# Altium project Ethernet2MIL Adapter.PrjPcb (part 2 of 3)

## Sheet Ethernet_PHY.SchDoc
size A2; SheetNumber: 11; SheetTotal: 14
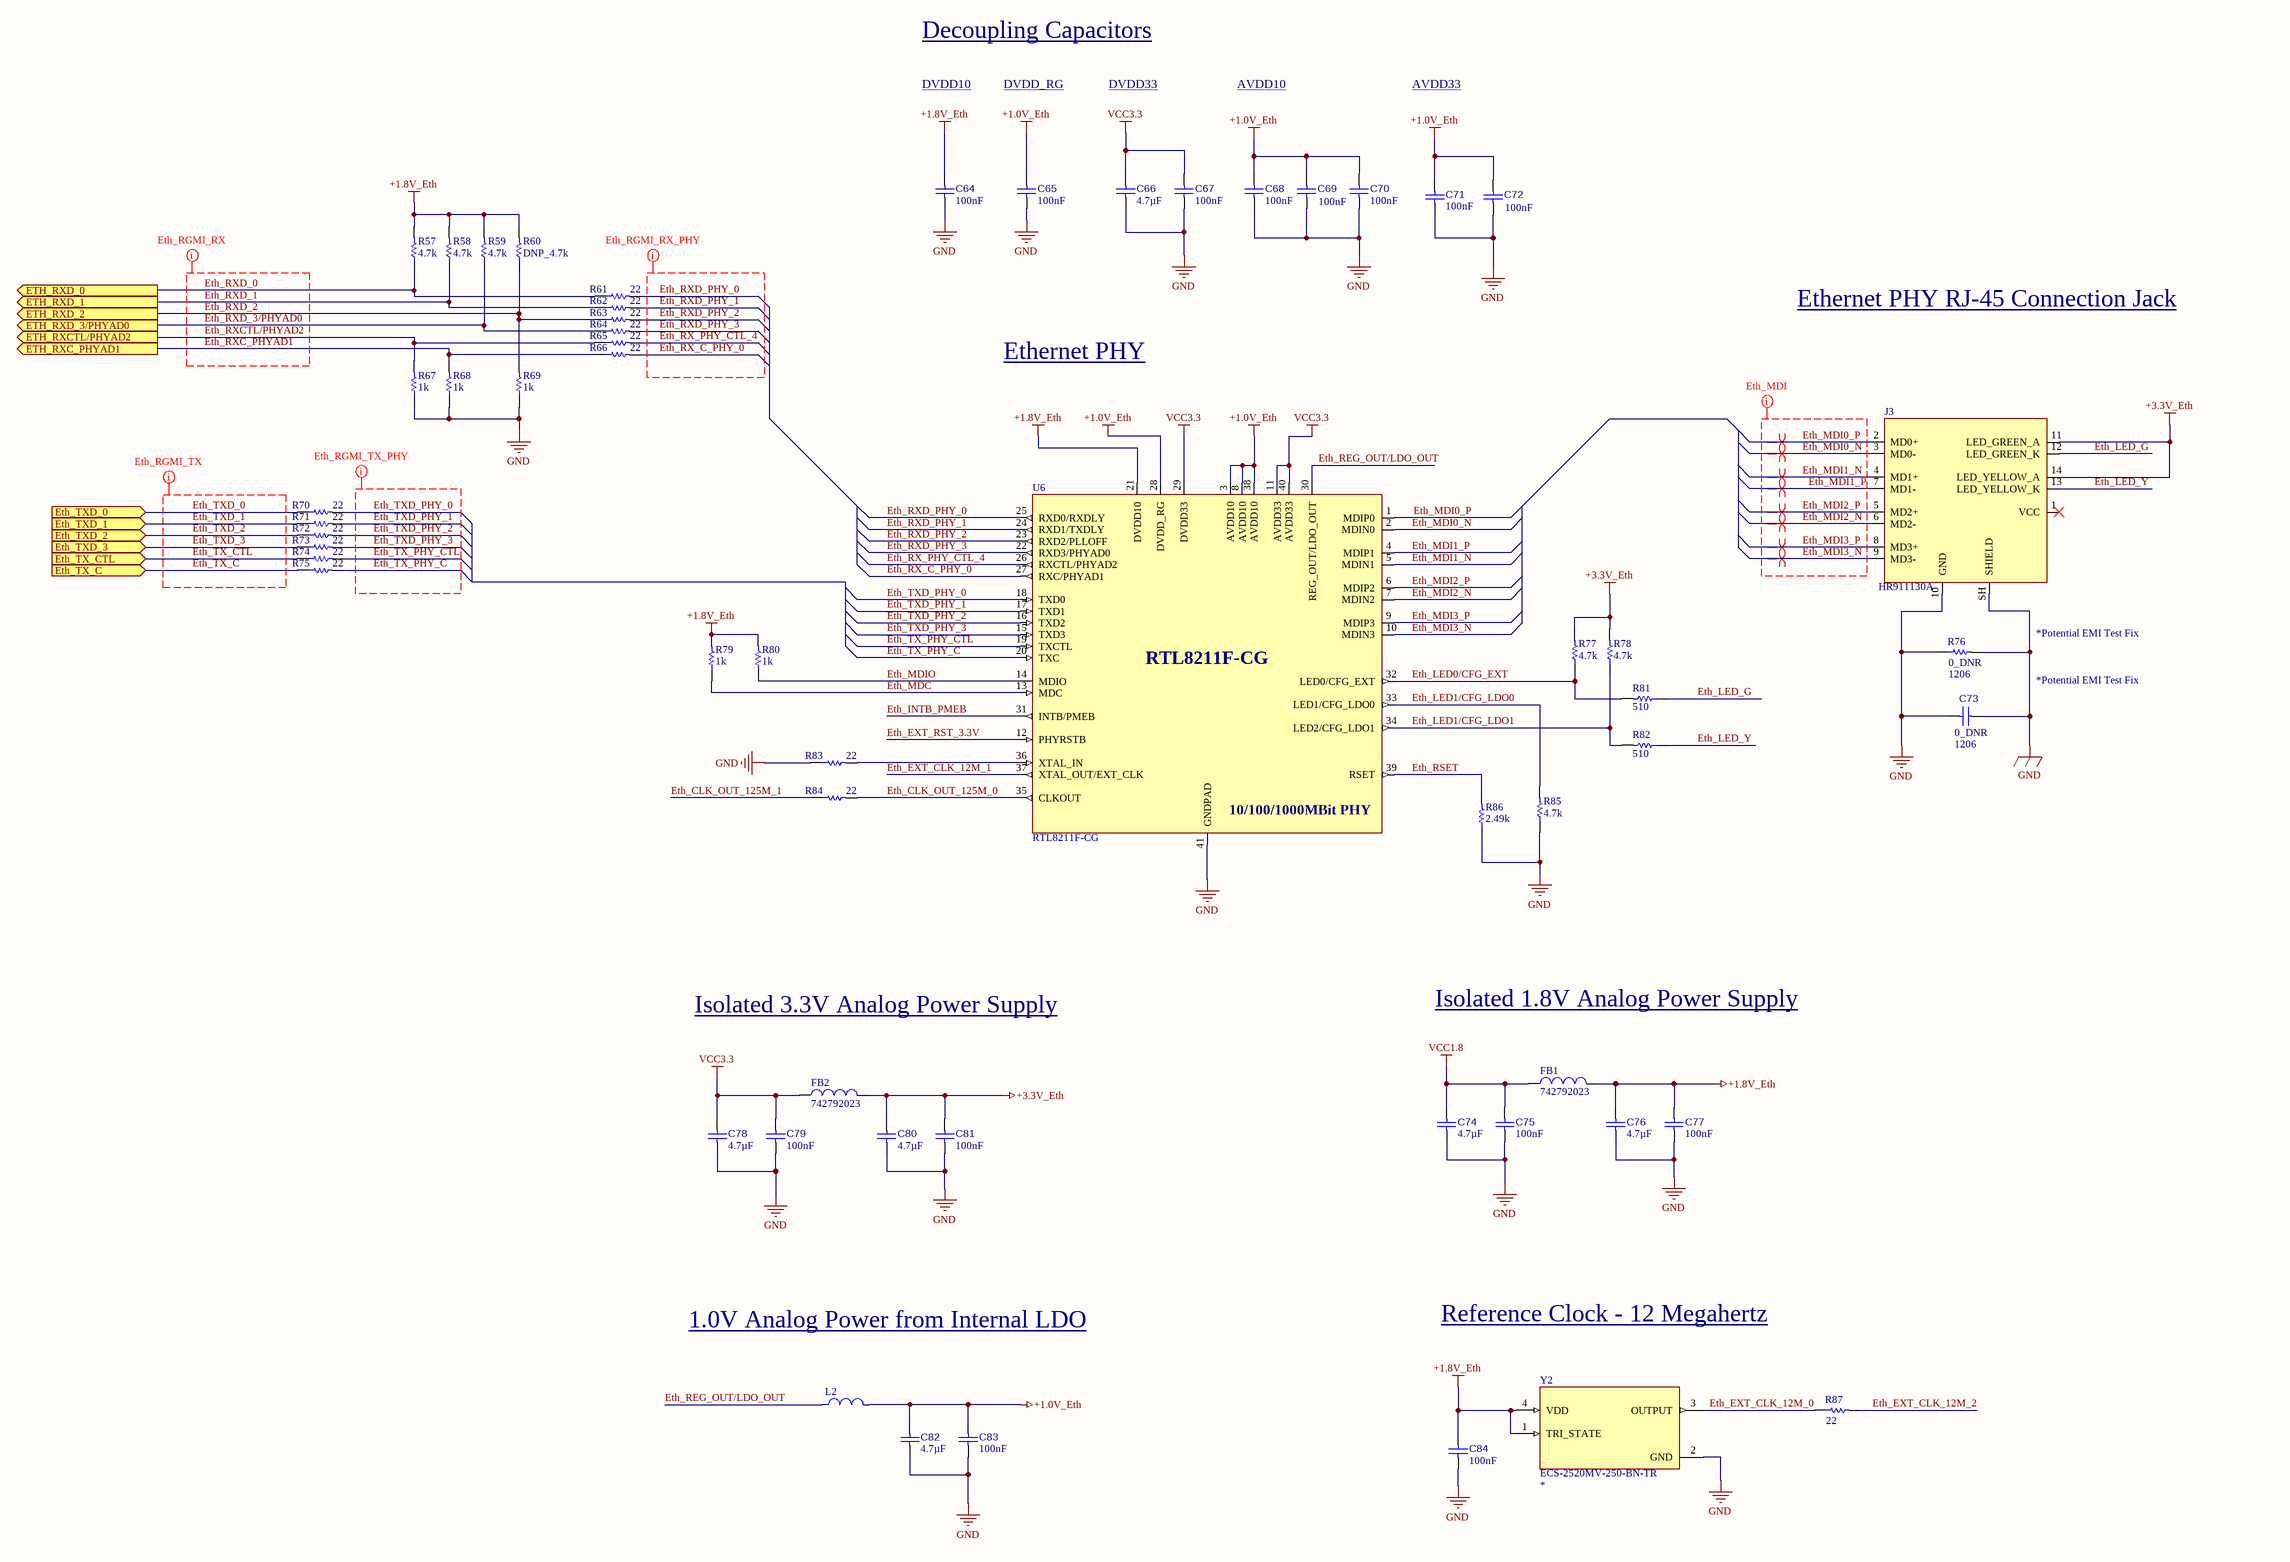
[diagram p6: Ethernet_PHY.SchDoc]

### Parts
C64  value 100nF  [CAPC1608X90X40NL10T20]  (hidden comment: Capacitor 100 nF +/-10% 50 V 0603)
C65  value 100nF  [CAPC1608X90X40NL10T20]  (hidden comment: Capacitor 100 nF +/-10% 50 V 0603)
C66  value 4.7µF  [CAPC0603(1608)100_L]  (hidden comment: Capacitor 4.7µF +/-20% 10V 0603)
C67  value 100nF  [CAPC1608X90X40NL10T20]  (hidden comment: Capacitor 100 nF +/-10% 50 V 0603)
C68  value 100nF  [CAPC1608X90X40NL10T20]  (hidden comment: Capacitor 100 nF +/-10% 50 V 0603)
C69  value 100nF  [CAPC1608X90X40NL10T20]  (hidden comment: Capacitor 100 nF +/-10% 50 V 0603)
C70  value 100nF  [CAPC1608X90X40NL10T20]  (hidden comment: Capacitor 100 nF +/-10% 50 V 0603)
C71  value 100nF  [CAPC1608X90X40NL10T20]  (hidden comment: Capacitor 100 nF +/-10% 50 V 0603)
C72  value 100nF  [CAPC1608X90X40NL10T20]  (hidden comment: Capacitor 100 nF +/-10% 50 V 0603)
C73  value 0_DNR  Case/Package: 1206  [CAPC3216X180X20ML20]  (hidden comment: Capacitor 1 uF +/- 10% 25 V 1206)
C74  value 4.7µF  [CAPC0603(1608)100_L]  (hidden comment: Capacitor 4.7µF +/-20% 10V 0603)
C75  value 100nF  [CAPC1608X90X40NL10T20]  (hidden comment: Capacitor 100 nF +/-10% 50 V 0603)
C76  value 4.7µF  [CAPC0603(1608)100_L]  (hidden comment: Capacitor 4.7µF +/-20% 10V 0603)
C77  value 100nF  [CAPC1608X90X40NL10T20]  (hidden comment: Capacitor 100 nF +/-10% 50 V 0603)
C78  value 4.7µF  [CAPC0603(1608)100_L]  (hidden comment: Capacitor 4.7µF +/-20% 10V 0603)
C79  value 100nF  [CAPC1608X90X40NL10T20]  (hidden comment: Capacitor 100 nF +/-10% 50 V 0603)
C80  value 4.7µF  [CAPC0603(1608)100_L]  (hidden comment: Capacitor 4.7µF +/-20% 10V 0603)
C81  value 100nF  [CAPC1608X90X40NL10T20]  (hidden comment: Capacitor 100 nF +/-10% 50 V 0603)
C82  value 4.7µF  [CAPC0603(1608)100_L]  (hidden comment: Capacitor 4.7µF +/-20% 10V 0603)
C83  value 100nF  [CAPC1608X90X40NL10T20]  (hidden comment: Capacitor 100 nF +/-10% 50 V 0603)
C84  value 100nF  [CAPC1608X90X40NL10T20]  (hidden comment: Capacitor 100 nF +/-10% 50 V 0603)
FB1  742792023  [WE-CBF_0805_L2W1.2H0.9_HC]
FB2  742792023  [WE-CBF_0805_L2W1.2H0.9_HC]
J3  HR911130A  [HR911130A]
L2  LQM18PN3R3MGHD  [FP-LQM18PN_GH-MFG]  (value not drawn)
R57  value 4.7k  [RESC1005X40X25ML05T05]  (hidden comment: Resistor 4k7 +/-1% 0402 100 mW)
R58  value 4.7k  [RESC1005X40X25ML05T05]  (hidden comment: Resistor 4k7 +/-1% 0402 100 mW)
R59  value 4.7k  [RESC1005X40X25ML05T05]  (hidden comment: Resistor 4k7 +/-1% 0402 100 mW)
R60  value DNP_4.7k  [RESC1005X40X25ML05T05]  (hidden comment: Resistor 4k7 +/-1% 0402 100 mW)  (net tie, no BOM)
R61  value 22  [RESC0402(1005)_L]  (hidden comment: Resistor 22R  +/-5 % 0402 63 mW)
R62  value 22  [RESC0402(1005)_L]  (hidden comment: Resistor 22R  +/-5 % 0402 63 mW)
R63  value 22  [RESC0402(1005)_L]  (hidden comment: Resistor 22R  +/-5 % 0402 63 mW)
R64  value 22  [RESC0402(1005)_L]  (hidden comment: Resistor 22R  +/-5 % 0402 63 mW)
R65  value 22  [RESC0402(1005)_L]  (hidden comment: Resistor 22R  +/-5 % 0402 63 mW)
R66  value 22  [RESC0402(1005)_L]  (hidden comment: Resistor 22R  +/-5 % 0402 63 mW)
R67  value 1k  [RESC1005X40X25ML05T05]  (hidden comment: Resistor 1k +/-1% 0402 100 mW)
R68  value 1k  [RESC1005X40X25ML05T05]  (hidden comment: Resistor 1k +/-1% 0402 100 mW)
R69  value 1k  [RESC1005X40X25ML05T05]  (hidden comment: Resistor 1k +/-1% 0402 100 mW)
R70  value 22  [RESC0402(1005)_L]  (hidden comment: Resistor 22R  +/-5 % 0402 63 mW)
R71  value 22  [RESC0402(1005)_L]  (hidden comment: Resistor 22R  +/-5 % 0402 63 mW)
R72  value 22  [RESC0402(1005)_L]  (hidden comment: Resistor 22R  +/-5 % 0402 63 mW)
R73  value 22  [RESC0402(1005)_L]  (hidden comment: Resistor 22R  +/-5 % 0402 63 mW)
R74  value 22  [RESC0402(1005)_L]  (hidden comment: Resistor 22R  +/-5 % 0402 63 mW)
R75  value 22  [RESC0402(1005)_L]  (hidden comment: Resistor 22R  +/-5 % 0402 63 mW)
R76  value 0_DNR  Case/Package: 1206  [RESC3116X70X50ML13T20]  (hidden comment: Resistor 0R +/- 0.05% 1206 250 mW)
R77  value 4.7k  [RESC1005X40X25ML05T05]  (hidden comment: Resistor 4k7 +/-1% 0402 100 mW)
R78  value 4.7k  [RESC1005X40X25ML05T05]  (hidden comment: Resistor 4k7 +/-1% 0402 100 mW)
R79  value 1k  [RESC1005X40X25ML05T05]  (hidden comment: Resistor 1k +/-1% 0402 100 mW)
R80  value 1k  [RESC1005X40X25ML05T05]  (hidden comment: Resistor 1k +/-1% 0402 100 mW)
R81  value 510  [RESC1005X40X25NL05T10]  (hidden comment: RC0402FR-07510RL)
R82  value 510  [RESC1005X40X25NL05T10]  (hidden comment: RC0402FR-07510RL)
R83  value 22  [RESC0402(1005)_L]  (hidden comment: Resistor 22R  +/-5 % 0402 63 mW)
R84  value 22  [RESC0402(1005)_L]  (hidden comment: Resistor 22R  +/-5 % 0402 63 mW)
R85  value 4.7k  [RESC1005X40X25ML05T05]  (hidden comment: Resistor 4k7 +/-1% 0402 100 mW)
R86  value 2.49k  [RESC1005X40X25NL05T10]  (hidden comment: RC0402FR-072K49L)
R87  value 22  [RESC0402(1005)_L]  (hidden comment: Resistor 22R  +/-5 % 0402 63 mW)
U6  RTL8211F-CG  [QFN-40-0.4-EP]
Y2  ECS-2520MV-250-BN-TR  [OSC_ECS-2520S25-250-FN-TR]

### Ports
ETH_RXC_PHYAD1 (out), ETH_RXCTL/PHYAD2 (out), ETH_RXD_0 (out), ETH_RXD_1 (out), ETH_RXD_2 (out), ETH_RXD_3/PHYAD0 (out), Eth_TX_C (in), Eth_TX_CTL (in), Eth_TXD_0 (in), Eth_TXD_1 (in), Eth_TXD_2 (in), Eth_TXD_3 (in)

### Nets
+1.0V_Eth: C65.2 C68.2 C69.2 C70.2 C71.2 C72.2 C82.2 C83.2 L2.2 U6.3(AVDD10) U6.8(AVDD10) U6.28(DVDD_RG) U6.38(AVDD10)
+1.8V_Eth: C64.2 C76.2 C77.2 C84.2 FB1.2 R57.2 R58.2 R59.2 R60.2 R79.2 R80.2 U6.21(DVDD10) Y2.1(TRI_STATE) Y2.4(VDD)
+3.3V_Eth: C80.2 C81.2 FB2.2 J3.11(LED_GREEN_A) J3.14(LED_YELLOW_A) R77.2 R78.2
GND: C64.1 C65.1 C66.1 C67.1 C68.1 C69.1 C70.1 C71.1 C72.1 C73.1 C73.2 C74.1 C75.1 C76.1 C77.1 C78.1 C79.1 C80.1 C81.1 C82.1 C83.1 C84.1 J3.10(GND) J3.SH(SHIELD) R67.1 R68.1 R69.1 R76.1 R76.2 R83.1 R85.1 R86.1 U6.41(GNDPAD) Y2.2(GND)
VCC1.8: C74.2 C75.2 FB1.1
VCC3.3: C66.2 C67.2 C78.2 C79.2 FB2.1 U6.11(AVDD33) U6.29(DVDD33) U6.40(AVDD33)
Eth_CLK_OUT_125M_0: R84.2 U6.35(CLKOUT)
Eth_CLK_OUT_125M_1: R84.1
Eth_EXT_CLK_12M_0: R87.1 Y2.3(OUTPUT)
Eth_EXT_CLK_12M_1: U6.37(XTAL_OUT/EXT_CLK)
Eth_EXT_CLK_12M_2: R87.2
Eth_EXT_RST_3.3V: U6.12(PHYRSTB)
Eth_INTB_PMEB: U6.31(INTB/PMEB)
Eth_LED0/CFG_EXT: R77.1 R81.2 U6.32(LED0/CFG_EXT)
Eth_LED1/CFG_LDO0: R85.2 U6.33(LED1/CFG_LDO0)
Eth_LED1/CFG_LDO1: R78.1 R82.2 U6.34(LED2/CFG_LDO1)
Eth_LED_G: J3.12(LED_GREEN_K) R81.1
Eth_LED_Y: J3.13(LED_YELLOW_K) R82.1
Eth_MDC: R79.1 U6.13(MDC)
Eth_MDI0_N: J3.3(MD0-) U6.2(MDIN0)
Eth_MDI0_P: J3.2(MD0+) U6.1(MDIP0)
Eth_MDI1_N: J3.4(MD1+) U6.5(MDIN1)
Eth_MDI1_P: J3.7(MD1-) U6.4(MDIP1)
Eth_MDI2_N: J3.6(MD2-) U6.7(MDIN2)
Eth_MDI2_P: J3.5(MD2+) U6.6(MDIP2)
Eth_MDI3_N: J3.9(MD3-) U6.10(MDIN3)
Eth_MDI3_P: J3.8(MD3+) U6.9(MDIP3)
Eth_MDIO: R80.1 U6.14(MDIO)
Eth_REG_OUT/LDO_OUT: L2.1 U6.30(REG_OUT/LDO_OUT)
Eth_RSET: R86.2 U6.39(RSET)
Eth_RX_C_PHY_0: R66.2 U6.27(RXC/PHYAD1)
Eth_RX_PHY_CTL_4: R65.2 U6.26(RXCTL/PHYAD2)
Eth_RXC_PHYAD1: R66.1 R68.2 ; port ETH_RXC_PHYAD1
Eth_RXCTL/PHYAD2: R65.1 R67.2 ; port ETH_RXCTL/PHYAD2
Eth_RXD_0: R57.1 R61.1 ; port ETH_RXD_0
Eth_RXD_1: R58.1 R62.1 ; port ETH_RXD_1
Eth_RXD_2: R60.1 R63.1 R69.2 ; port ETH_RXD_2
Eth_RXD_3/PHYAD0: R59.1 R64.1 ; port ETH_RXD_3/PHYAD0
Eth_RXD_PHY_0: R61.2 U6.25(RXD0/RXDLY)
Eth_RXD_PHY_1: R62.2 U6.24(RXD1/TXDLY)
Eth_RXD_PHY_2: R63.2 U6.23(RXD2/PLLOFF)
Eth_RXD_PHY_3: R64.2 U6.22(RXD3/PHYAD0)
Eth_TX_C: R75.1 ; port Eth_TX_C
Eth_TX_CTL: R74.1 ; port Eth_TX_CTL
Eth_TX_PHY_C: R75.2 U6.20(TXC)
Eth_TX_PHY_CTL: R74.2 U6.19(TXCTL)
Eth_TXD_0: R70.1 ; port Eth_TXD_0
Eth_TXD_1: R71.1 ; port Eth_TXD_1
Eth_TXD_2: R72.1 ; port Eth_TXD_2
Eth_TXD_3: R73.1 ; port Eth_TXD_3
Eth_TXD_PHY_0: R70.2 U6.18(TXD0)
Eth_TXD_PHY_1: R71.2 U6.17(TXD1)
Eth_TXD_PHY_2: R72.2 U6.16(TXD2)
Eth_TXD_PHY_3: R73.2 U6.15(TXD3)
NetR83_2: R83.2 U6.36(XTAL_IN)

Not connected (* = marked no-connect by the designer): J3 1(VCC)*

### Layout directives
net class Ethernet RGMI Rx PHY: Eth_RX_C_PHY_0, Eth_RX_PHY_CTL_4, Eth_RXD_PHY_0, Eth_RXD_PHY_1, Eth_RXD_PHY_2, Eth_RXD_PHY_3
net class Ethernet RGMI Tx PHY: Eth_TX_PHY_C, Eth_TX_PHY_CTL, Eth_TXD_PHY_0, Eth_TXD_PHY_1, Eth_TXD_PHY_2, Eth_TXD_PHY_3
net class Ethernet MDI: Eth_MDI0_N, Eth_MDI0_P, Eth_MDI1_N, Eth_MDI1_P, Eth_MDI2_N, Eth_MDI2_P, Eth_MDI3_N, Eth_MDI3_P
net class Ethernet RGMI TX: Eth_TX_C, Eth_TX_CTL, Eth_TXD_0, Eth_TXD_1, Eth_TXD_2, Eth_TXD_3
net class Ethernet RGMI Rx: Eth_RXC_PHYAD1, Eth_RXCTL/PHYAD2, Eth_RXD_0, Eth_RXD_1, Eth_RXD_2, Eth_RXD_3/PHYAD0
differential pair: Eth_MDI0_N, Eth_MDI0_P, Eth_MDI1_N, Eth_MDI1_P, Eth_MDI2_N, Eth_MDI2_P, Eth_MDI3_N, Eth_MDI3_P

### Notes on the sheet
- Decoupling Capacitors
- DVDD10
- DVDD_RG
- DVDD33
- AVDD10
- AVDD33
- Ethernet PHY
- Ethernet PHY RJ-45 Connection Jack
- *Potential EMI Test Fix
- Isolated 3.3V Analog Power Supply
- Isolated 1.8V Analog Power Supply
- 1.0V Analog Power from Internal LDO
- Reference Clock - 12 Megahertz
- (in symbol CMP-049-000049-1) 10/100/1000MBit PHY

### Library data of the parts
C64 C65 C67-C72 C75 C77 C79 C81 C83 C84 = CMP-001-00017-7: Chip Capacitor, 100 nF, +/- 10%, 50 V, 0603 (1608 Metric); Voltage Rating: 50V; Capacitor Type: Ceramic; Mounting Technology: SM; Pins: 2; Tolerance: 10%; Case/Package: 0603; Max Operating Temperature: 125°C; Min Operating Temperature: -55°C; RoHS Compliant: True
C66 C74 C76 C78 C80 C82 = CMP-001-00076-5: Chip Capacitor, 4.7µF +/-20%, 10V, 0603, Thickness 1 mm; Tolerance: 10%; Max Operating Temperature: 85°C; Min Operating Temperature: -55°C; Voltage Rating: 10V; Pins: 2; Mounting Technology: SMT; Case/Package: 0603
C73 = CMP-001-00006-7: Chip Capacitor, 1 uF, +/- 10%, 25 V, 1206 (3216 Metric); Voltage Rating: 25V; Capacitor Type: Ceramic; Mounting Technology: SM; Max Operating Temperature: 125°C; RoHS Compliant: True; Tolerance: 10%; Pins: 2; Min Operating Temperature: -55°C
FB1 FB2 = CMP-0220-00030-2: NexarPartId: 8916989; Manufacturer: Wurth Electronics; Number of Lines: 1; Impedance: 120Ω; Max Current Rating: 3A; Tolerance: 25%; Resistance: 30mΩ; Shielding: Unshielded; Inductance: 1H; Test Frequency: 100MHz; DC Resistance-Max: 30mR; Filter Type: FERRITE CHIP; Clock Frequency: 250MHz; Output Impedance: 120R; Height: 900µm; REACH SVHC: Unknown; Termination: SMD/SMT; Weight: 10.999615mg; Max Operating Temperature: 125°C; Length: 2mm; Min Operating Temperature: -55°C; Case Code (Imperial): 0805; Core Material: Ferrite; Current Rating: 3A; Lead Free: Lead Free; Mount: Surface Mount; Width: 1.2mm; Case Code (Metric): 2012; RoHS: Compliant; Case/Package: SMD/SMT; Max DC Current: 3A; Depth: 1.2mm; Packaging: Cut Tape (CT); DC Resistance (DCR): 30mΩ; Supplier: Newark; Supplier Part Number: 24AC5582; Manufacturer Part Number: 742792023; Category: Ferrite Beads and Chips; Stock: 8000; Pricing: 4000=0.17 (USD); Mounting Technology: Surface Mount; Material: Ferrite; Case Code: 0805; Terminal Finish: Nickel; Min Frequency: 100MHz; Channels: 1; JESD-609 Code: e3; Construction: Multi-Layer; Reach SVHC Compliant: Yes; RoHS Compliant: Yes; ComponentLink1URL: https://datasheet.ciiva.com:443/pdfs/VipMasterIC/IC/MIDC/MIDC-S-A0008919821/MIDC-S-A0008918329-1.pdf?src-supplier=IHS+Markit; ComponentLink1Description: https://datasheet.ciiva.com:443/pdfs/VipMasterIC/IC/MIDC/MIDC-S-A0008919821/MIDC-S-A0008918329-1.pdf?src-supplier=IHS+Markit; ComponentLink2URL: https://datasheet.ciiva.com/1013/742792023-1013536.pdf?src-supplier=Digikey; ComponentLink2Description: https://datasheet.ciiva.com/1013/742792023-1013536.pdf?src-supplier=Digikey; ComponentLink3URL: https://datasheet.ciiva.com/4940/742792023-80959-4940415.pdf?src-supplier=Mouser; ComponentLink3Description: https://datasheet.ciiva.com/4940/742792023-80959-4940415.pdf?src-supplier=Mouser; ComponentLink4URL: https://datasheet.ciiva.com/11803/0900766b80bbd134-11803678.pdf?src-supplier=Rs; ComponentLink4Description: https://datasheet.ciiva.com/11803/0900766b80bbd134-11803678.pdf?src-supplier=Rs; ComponentLink5URL: https://datasheet.ciiva.com/1126/1695980-1126531.pdf?src-supplier=Element14; ComponentLink5Description: https://datasheet.ciiva.com/1126/1695980-1126531.pdf?src-supplier=Element14; ComponentLink6URL: https://datasheet.ciiva.com/6739/742792023-6739069.pdf?src-supplier=Newark; ComponentLink6Description: https://datasheet.ciiva.com/6739/742792023-6739069.pdf?src-supplier=Newark; ComponentLink7URL: https://datasheet.ciiva.com/1013/742792023-1013537.pdf?src-supplier=Digikey; ComponentLink7Description: https://datasheet.ciiva.com/1013/742792023-1013537.pdf?src-supplier=Digikey; ComponentLink8URL: https://datasheet.ciiva.com/1013/742792023-1013538.pdf?src-supplier=Digikey; ComponentLink8Description: https://datasheet.ciiva.com/1013/742792023-1013538.pdf?src-supplier=Digikey; ComponentLink9URL: https://datasheet.ciiva.com/48698/001086956-da-01-ml-we-cbf-smd-ferrit-742792023-de-en-48698517.pdf?src-supplier=Conrad; ComponentLink9Description: https://datasheet.ciiva.com/48698/001086956-da-01-ml-we-cbf-smd-ferrit-742792023-de-en-48698517.pdf?src-supplier=Conrad
J3 = CMP-002-00088-1: 100/1000Base-T Magnetics Single-Port RJ45 Connector with Integrated Magnetics and LEDs; Manufacturer: Hanrun; Manufacturer Part Number: HR911130A; Source: Schematic-Lib-PhilsLab.SchLib; Design Item ID: HR911130A
L2 = CMP-006-00047-1: General Purpose Inductor, 3.3uH, 20%, 1 Element, Ferrite-Core, SMD, 0603; Max Current Rating: 1.05A; Self Resonant Frequency: 30MHz; RoHS Compliant: Yes; Max Operating Temperature: 85°C; Min Operating Temperature: -40°C; Pins: 2; Tolerance: 20%
R57-R60 R77 R78 R85 = CMP-009-00030-6: Chip Resistor, 4.7 KOhm, +/- 1%, 0.1 W, -55 to 155 degC, 0402 (1005 Metric); Voltage Rating: 50V; Power: 100mW; Max Operating Temperature: 155°C; RoHS Compliant: True; Min Operating Temperature: -55°C; Pins: 2; Tolerance: 1%; Mounting Technology: SM; Case/Package: 0402
R61-R66 R70-R75 R83 R84 R87 = CMP-009-00164-4: Chip Resistor, 22 Ohms, +/-5 %, 63 mW, -55 to 155 degC, 0402; Power: 63mW; Tolerance: 5%; Max Operating Temperature: 155°C; Pins: 2; Min Operating Temperature: -55°C; Case/Package: 0402
R67-R69 R79 R80 = CMP-009-00009-5: Chip Resistor, 1 KOhm, +/- 1%, 0.1 W, -55 to 155 degC, 0402 (1005 Metric); Power: 100mW; Voltage Rating: 50V; Min Operating Temperature: -55°C; Max Operating Temperature: 155°C; RoHS Compliant: True; Mounting Technology: SM; Pins: 2; Tolerance: 1%; Case/Package: 0402
R76 = CMP-009-00008-6: Chip Resistor, 0 Ohm, 0.25 W, -55 to 155 degC, 1206 (3216 Metric); Voltage Rating: 200V; Power: 0_DNR; RoHS Compliant: True; Max Operating Temperature: 155°C; Mounting Technology: SM; Min Operating Temperature: -55°C; Tolerance: 0.05%; Pins: 2
R81 R82 = CMP-009-00202-1: Fixed Resistor, Metal Glaze/thick Film, 0.0625W, 510ohm, 50V, 1% +/-Tol, 100ppm/Cel, Surface Mount, 0402; Power: 62.5mW; Pins: 2; Max Operating Temperature: 155°C; Case/Package: 0402; Tolerance: 1%; Min Operating Temperature: -55°C; RoHS Compliant: Yes; Mounting Technology: Surface Mount
R86 = CMP-009-00200-1: Fixed Resistor, Metal Glaze/thick Film, 0.0625W, 2490ohm, 50V, 1% +/-Tol, 100ppm/Cel, Surface Mount, 0402; Power: 62.5mW; Case/Package: 0402; Pins: 2; Mounting Technology: Surface Mount; Tolerance: 1%; Max Operating Temperature: 155°C; Min Operating Temperature: -55°C; RoHS Compliant: Yes
U6 = CMP-049-000049-1: INTEGRATED 10/100/1000M ETHERNET PRECISION TRANSCEIVER; Manufacturer: Realtek; Manufacturer Part Number: RTL8211F-CG; Design Item ID: RTL8211F-CG; Source: Schematic-Lib-PhilsLab.SchLib
Y2 = CMP-029-000000-1: 25 MHz XO (Standard) HCMOS Oscillator 1.6V ~ 3.6V Enable/Disable 4-SMD, No Lead; MF: ECS Inc.; Design Item ID: ECS-2520MV-250-BN-TR; MP: ECS-2520MV-250-BN-TR; Component Type: Standard; Value: *; SnapEDA_Link: https://www.snapeda.com/parts/ECS-2520MV-250-BN-TR/ECS/view-part/?ref=snap; Pin Count: 4; Source: ECS-2520MV-250-BN-TR.SchLib; Check_prices: https://www.snapeda.com/parts/ECS-2520MV-250-BN-TR/ECS/view-part/?ref=eda; Package: ECS-2520MV-0-4 ECS

## Sheet Mechancils.SchDoc
size A; SheetNumber: 14; SheetTotal: 14
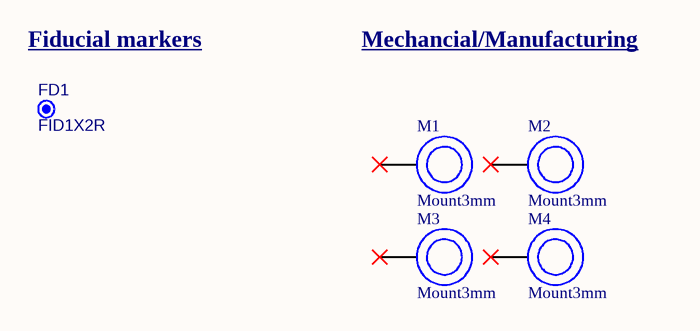
[diagram p7: Mechancils.SchDoc]

### Parts
FD1  FID1X2R  [FID1X2R]  (no BOM)
M1  Mount3mm  [Mount3mm-Footprint-1]  (no BOM)
M2  Mount3mm  [Mount3mm-Footprint-1]  (mechanical)
M3  Mount3mm  [Mount3mm-Footprint-1]  (mechanical)
M4  Mount3mm  [Mount3mm-Footprint-1]  (mechanical)

### Nets

Not connected (* = marked no-connect by the designer): M1 1(Sheild/GND); M2 1(Sheild/GND); M3 1(Sheild/GND); M4 1(Sheild/GND)

### Notes on the sheet
- (near FD1) Fiducial markers
- Mechancial/Manufacturing

### Library data of the parts
FD1 = CMP-00028-00005-2: Fiducial - Round 1x2mm; Pins: 0
M1-M4 = CMP-00028-00009-1: Mounting holes with 3mm holes.

## Sheet Power_SwitchRegulators.SchDoc
size A2; SheetNumber: 3; SheetTotal: 14
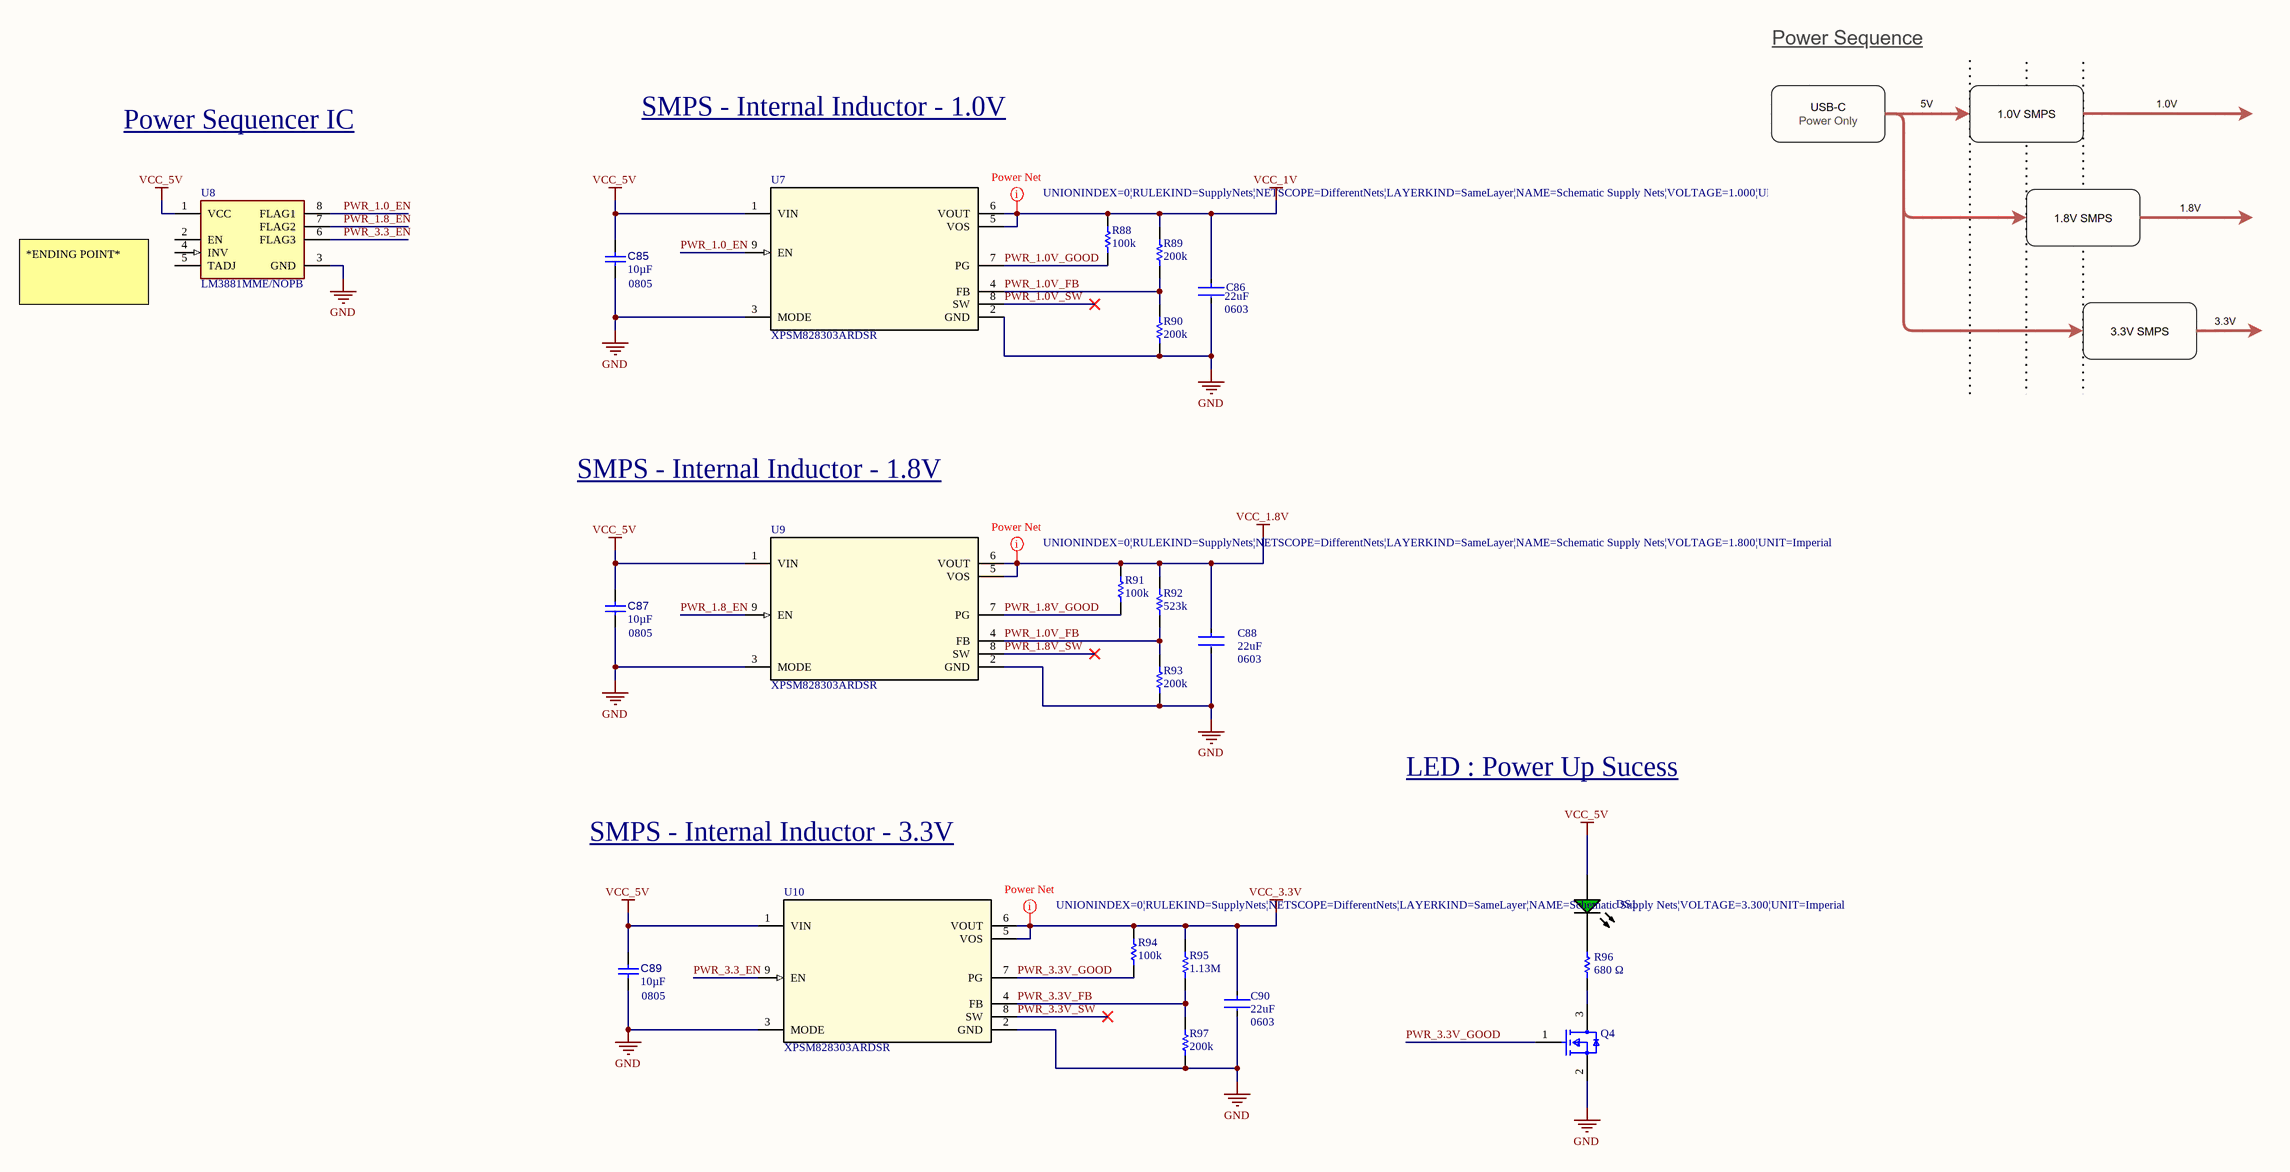
[diagram p8: Power_SwitchRegulators.SchDoc]

### Parts
C85  value 10µF  Case/Package: 0805  [CAPC0805(2012)145_L]  (hidden comment: Capacitor 10µF +/-20% 25V 0805)
C86  Capacitance: 22uF  Case/Package: 0603  [FP-GRM188-0_2-IPC_C]  (hidden comment: GRM188R60J226MEA0J)
C87  value 10µF  Case/Package: 0805  [CAPC0805(2012)145_L]  (hidden comment: Capacitor 10µF +/-20% 25V 0805)
C88  Capacitance: 22uF  Case/Package: 0603  [FP-GRM188-0_2-IPC_C]  (hidden comment: GRM188R60J226MEA0J)
C89  value 10µF  Case/Package: 0805  [CAPC0805(2012)145_L]  (hidden comment: Capacitor 10µF +/-20% 25V 0805)
C90  Capacitance: 22uF  Case/Package: 0603  [FP-GRM188-0_2-IPC_C]  (hidden comment: GRM188R60J226MEA0J)
DS1  HSMG-C170  [AVAG-HSMX-C170_V]  (value not drawn)
Q4  BSS138  [FP-318-08-IPC_B]  (value not drawn)
R88  value 100k  [RESC1005X40X25ML05T05]  (hidden comment: Resistor 100k +/-1% 0402 63 mW)
R89  value 200k  [RESC0402(1005)_L]  (hidden comment: Resistor 200K +/-1 % 0402 63 mW)
R90  value 200k  [RESC0402(1005)_L]  (hidden comment: Resistor 200K +/-1 % 0402 63 mW)
R91  value 100k  [RESC1005X40X25ML05T05]  (hidden comment: Resistor 100k +/-1% 0402 63 mW)
R92  value 523k  [RESC1005X40X25LL10T10]  (hidden comment: CR0402-FX-5233GLF)
R93  value 200k  [RESC0402(1005)_L]  (hidden comment: Resistor 200K +/-1 % 0402 63 mW)
R94  value 100k  [RESC1005X40X25ML05T05]  (hidden comment: Resistor 100k +/-1% 0402 63 mW)
R95  value 1.13M  [RESC1005X40X25NL05T05]  (hidden comment: CRCW04021M13FKED)
R96  Resistance: 680 Ω  [RESC1608X55X25ML10T15]  (hidden comment: RC0603JR-070RL)
R97  value 200k  [RESC0402(1005)_L]  (hidden comment: Resistor 200K +/-1 % 0402 63 mW)
U7  XPSM828303ARDSR  [RDS0009A-MFG]
U8  LM3881MME/NOPB  [FP-DGK0008A-IPC_B]
U9  XPSM828303ARDSR  [RDS0009A-MFG]
U10  XPSM828303ARDSR  [RDS0009A-MFG]

### Nets
GND: C85.1 C86.2 C87.1 C88.2 C89.1 C90.2 Q4.2(S) R90.1 R93.1 R97.1 U7.2(GND) U7.3(MODE) U8.3(GND) U9.2(GND) U9.3(MODE) U10.2(GND) U10.3(MODE)
VCC_1.8V: C88.1 R91.2 R92.1 U9.5(VOS) U9.6(VOUT)
VCC_1V: C86.1 R88.2 R89.2 U7.5(VOS) U7.6(VOUT)
VCC_3.3V: C90.1 R94.2 R95.2 U10.5(VOS) U10.6(VOUT)
VCC_5V: C85.2 C87.2 C89.2 DS1.1(A) U7.1(VIN) U8.1(VCC) U9.1(VIN) U10.1(VIN)
PWR_1.0_EN: U7.9(EN) U8.8(FLAG1)
PWR_1.0V_FB: R89.1 R90.2 R92.2 R93.2 U7.4(FB) U9.4(FB)
PWR_1.0V_GOOD: R88.1 U7.7(PG)
PWR_1.0V_SW: U7.8(SW)
PWR_1.8_EN: U8.7(FLAG2) U9.9(EN)
PWR_1.8V_GOOD: R91.1 U9.7(PG)
PWR_1.8V_SW: U9.8(SW)
PWR_3.3_EN: U8.6(FLAG3) U10.9(EN)
PWR_3.3V_FB: R95.1 R97.2 U10.4(FB)
PWR_3.3V_GOOD: Q4.1(G) R94.1 U10.7(PG)
PWR_3.3V_SW: U10.8(SW)
NetDS1_2: DS1.2(K) R96.1
NetQ4_3: Q4.3(D) R96.2

Not connected (* = marked no-connect by the designer): U8 2(EN) 4(INV) 5(TADJ)

### Layout directives
rule Supply Nets [Voltage = 1.000]: VCC_1V
rule Supply Nets [Voltage = 1.800]: VCC_1.8V
rule Supply Nets [Voltage = 3.300]: VCC_3.3V

### Notes on the sheet
- Power Sequencer IC
- SMPS - Internal Inductor - 1.0V
- *ENDING POINT*
- SMPS - Internal Inductor - 1.8V
- LED : Power Up Sucess
- SMPS - Internal Inductor - 3.3V

### Library data of the parts
C85 C87 C89 = CMP-001-00079-5: Chip Capacitor, 10µF +/-20%, 25V, 0805, Thickness 1.45 mm; Tolerance: 10%; Pins: 2; Voltage Rating: 25V; Mounting Technology: SMT; Min Operating Temperature: -55°C; Max Operating Temperature: 85°C
C86 C88 C90 = CMP-06035-027361-1: Chip Multilayer Ceramic Capacitors for General Purpose, 0603, 22uF, X5R, 15%, 20%, 6.3V; Case Code (Metric): 1608; Thickness: 0.039inch; Dielectric: X5R; Voltage Rating: 6.3V; Termination: SMD/SMT; Voltage Rating (DC): 6.3V; Width: 0.031inch; Weight: 0.000222oz; Tolerance: 20%; Lead Free: Lead Free; Package Quantity: 10000; Case Code (Imperial): 0603; Length: 0.063inch; Packaging: Tape and Reel; Max Operating Temperature: 85°C; Min Operating Temperature: -55°C; Mount: Surface Mount
DS1 = CMP-2000-05062-1: Chip LED, Green, 2.2 V, -40 to 85 degC, 2-Pin SMD, Pb-Free, Tape and Reel; Manufacturer: Avago; No. of Pins: 2; Peak Wavelength: 570nm; SVHC: NoSVHC(16-Jun-2014); Dominant Wavelength: 572nm; Forward Current If: 20mA; Viewing Angle: 170deg; Lens Shape: Rectangular; PIV Max: 5V; External Width: 1.25mm; LED Type: Standard; External Depth: 0.8mm; Opto Mounting Orientation: Top; Luminous Intensity: 15mcd; Luminous Intensity Min: 4mcd; Forward Voltage VF Max: 2.6V; External Length / Height: 2mm; Bulb Size: 1.25mmx1.4mm; Light Area Height: 1mm; Voltage Vf Typ: 2.2V; Operating Temperature Max: 85degC; Datasheet Version: Oct-08; MSL: MSL2A-4weeks; Peak Forward Current: 20mA; Package Description: 2-Pin Surface Mount Device, Body 2 x 1.25 mm, Height 0.8 mm; Datasheet URL: https://datasheet.ciiva.com/29280/180495-da-01-en-chip-led-hsmg-c170-gelb-gruen-29280971.pdf; Storage Temperature Min: -40degC; LED Colour: Green; Wavelength Typ: 570nm; Mounting Type: SMD; Forward Current If Max: 20mA; Dominant Wavelength Typ: 572nm; LED Mounting: SMD; Operating Temperature Range: -30degCto+85degC; Operating Temperature Min: -30degC; Manufacturer URL: http://www.avagotech.com/; Packaging: CutTape; Luminous Intensity Typ: 15mcd; Package Reference: HSMX-C170; Storage Temperature Max: 85degC; Opto Case Style: SMD; Forward Voltage: 2.2V
Q4 = CMP-07173-000101-1: MOSFET N-CH 50V 220MA SOT-23; Turn-Off Delay Time: 20ns; Element Configuration: Single; Rds On Max: 3.5R; Gate to Source Voltage (Vgs): 20V; Threshold Voltage: 1.3V; Number of Elements: 1; Power Dissipation: 360mW; Rise Time: 9ns; Turn-On Delay Time: 2.5ns; Input Capacitance: 27pF; On-State Resistance: 6R; Lead Free: Lead Free; Length: 2.92mm; Width: 1.3mm; Drain to Source Breakdown Voltage: 50V; Min Operating Temperature: -55°C; REACH SVHC: No SVHC; Packaging: Tape and Reel; Radiation Hardening: No; Height: 0.93mm; Drain to Source Voltage (Vdss): 50V; Current Rating: 220mA; Voltage Rating (DC): 50V; Weight: 0.03g; Continuous Drain Current (ID): 220mA; Number of Pins: 3; Nominal Vgs: 1.3V; Max Power Dissipation: 360mW; Fall Time: 9ns; Drain to Source Resistance: 3.5R; Contact Plating: Tin; Case/Package: SOT-23; Package Quantity: 1; Dual Supply Voltage: 50V; Mount: Surface Mount; Termination: SMD/SMT; Max Operating Temperature: 150°C
R88 R91 R94 = CMP-009-00021-6: Chip Resistor, 100 KOhm, +/- 1%, 0.063 W, -55 to 155 degC, 0402 (1005 Metric); Power: 63mW; Voltage Rating: 50V; Case/Package: 0402; RoHS Compliant: True; Max Operating Temperature: 155°C; Mounting Technology: SM; Tolerance: 1%; Min Operating Temperature: -55°C; Pins: 2
R89 R90 R93 R97 = CMP-009-00163-4: Chip Resistor, 200 kOhms, +/-1 %, 63 mW, -55 to 155 degC, 0402; Tolerance: 1%; Power: 63mW; Min Operating Temperature: -55°C; Pins: 2; Max Operating Temperature: 155°C; Case/Package: 0402
R92 = CMP-009-00203-1: Res Thick Film 0402 523K Ohm 1% 1/16W 100ppm/C Molded SMD SMD Paper Tape on Plastic Reel; Voltage Rating: 50V; Max Operating Temperature: 155°C; Case/Package: 0402; Mounting Technology: Surface Mount; Tolerance: 1%; Min Operating Temperature: -55°C
R95 = CMP-009-00207-1: Res Thick Film 0402 1.13M Ohm 1% 0.063W(1/16W) ±100ppm/C Pad SMD T/R Automotive; Voltage Rating: 50V; Max Operating Temperature: 155°C; Pins: 2; Mounting Technology: Surface Mount; Case/Package: 0402; Tolerance: 1%; Min Operating Temperature: -55°C
R96 = CMP-2100-03667-1: Chip Resistor, 0 Ohm, +/- 5%, 0.1 W, -55 to 155 degC, 0603 (1608 Metric), RoHS, Tape and Reel; Manufacturer: Yageo; Temperature Coefficient: 200ppm/degreesC; Voltage Rating: 50V; Power Rating: 100mW; Width: 0.8mm; Max Operating Temperature: 155degC; Tolerance: 5%; Package Reference: 0603; Height: 0.45mm; Depth: 0.8mm; Package Description: 2-Pin Surface Mount Device, Body 1.6 x 0.8 mm; Termination: SMD/SMT; Package Quantity: 5000; Case/Package: 0603; Case Code (Imperial): 0603; Radiation Hardening: No; Number of Pins: 2; Length: 1.6mm; Lead Free: LeadFree; Voltage Rating (DC): 50V; Military Standard: Not; Datasheet URL: http://www.yageo.com/NewPortal/yageodocoutput?fileName=/pdf/R-Chip/PYu-RC_Group_51_RoHS_L_5.pdf; Manufacturer URL: http://www.yageo.com/; Packaging: TapeandReel; Case Code (Metric): 1608; Min Operating Temperature: -55degC; Composition: ThickFilm; RoHSCompliant: true; Contact Plating: Tin; Datasheet Version: Rev. 5, 10/2016; REACH SVHC: NoSVHC
U7 U9 U10 = CMP-006-00049-1: 2.25-V to 5.5-V, 3-A, low-noise step-down module with integrated inductor in QFN package 9-QFN-FCMOD -40 to 125; Manufacturer_Name: Texas Instruments; Datasheet: https://www.ti.com/lit/gpn/tpsm828303; TYPE: TYPE; Copyright: Copyright (C) 2025 Ultra Librarian. All rights reserved.; Source: XPSM828303ARDSR.SchLib; Manufacturer_Part_Number: XPSM828303ARDSR; Design Item ID: XPSM828303ARDSR; RefDes: RefDes; ComponentLink1Description: New link; ComponentLink1URL: *
U8 = CMP-019-00053-1: 3 rail simple power sequencer with adjustable time delay 8-VSSOP -40 to 125; Nominal Supply Current: 80µA; Output Current: 1nA; Min Supply Voltage: 2.7V; Max Supply Voltage: 5.5V; Min Operating Temperature: -40°C; Pins: 8; Mounting Technology: Surface Mount; Case/Package: VSSOP; Max Operating Temperature: 125°C

## Sheet USB_FTDI.SchDoc
size A2; SheetNumber: 9; SheetTotal: 14
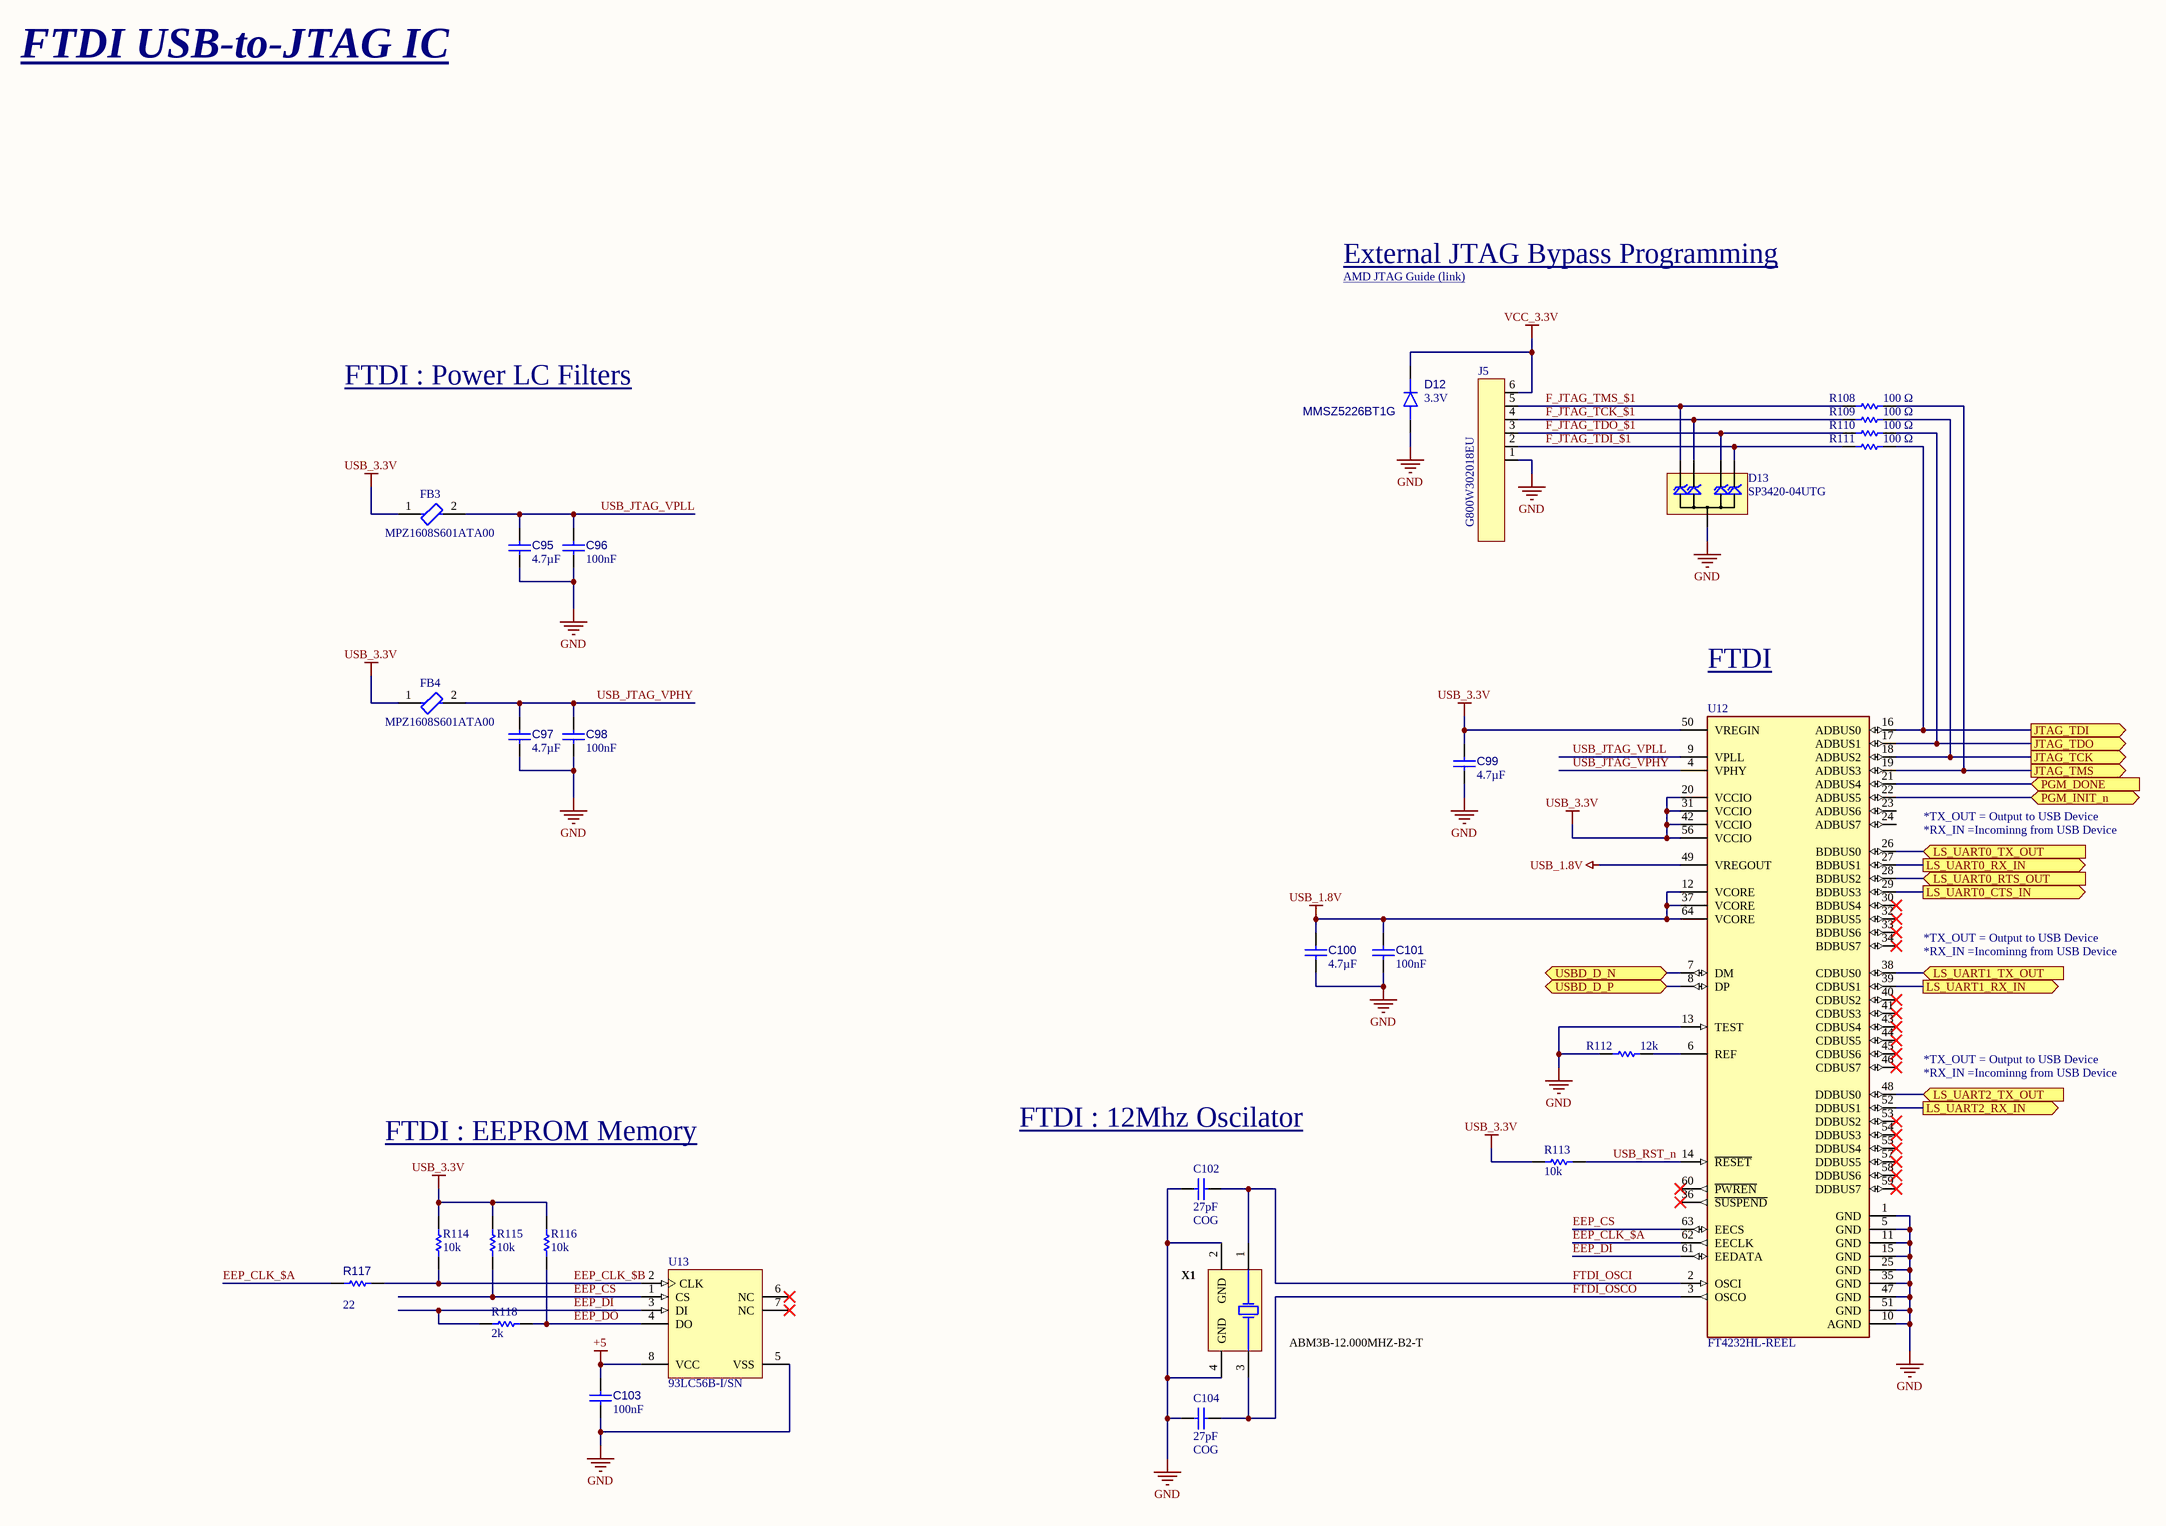
[diagram p9: USB_FTDI.SchDoc]

### Parts
C95  value 4.7µF  [CAPC0603(1608)100_L]  (hidden comment: Capacitor 4.7µF +/-20% 10V 0603)
C96  value 100nF  [CAPC1005X56X25LL10T15]  (hidden comment: Capacitor 0.1 uF +/- 5% 16 V 0402)
C97  value 4.7µF  [CAPC0603(1608)100_L]  (hidden comment: Capacitor 4.7µF +/-20% 10V 0603)
C98  value 100nF  [CAPC1005X56X25LL10T15]  (hidden comment: Capacitor 0.1 uF +/- 5% 16 V 0402)
C99  value 4.7µF  [CAPC0603(1608)100_L]  (hidden comment: Capacitor 4.7µF +/-20% 10V 0603)
C100  value 4.7µF  [CAPC0603(1608)100_L]  (hidden comment: Capacitor 4.7µF +/-20% 10V 0603)
C101  value 100nF  [CAPC1005X56X25LL10T15]  (hidden comment: Capacitor 0.1 uF +/- 5% 16 V 0402)
C102  value 27pF  Capacitor Material Type: COG  [FP-C0402-BB-MFG]  (hidden comment: C0402C270F5GACTU)
C103  value 100nF  [CAPC1005X56X25LL10T15]  (hidden comment: Capacitor 0.1 uF +/- 5% 16 V 0402)
C104  value 27pF  Capacitor Material Type: COG  [FP-C0402-BB-MFG]  (hidden comment: C0402C270F5GACTU)
D12  MMSZ5226BT1G  Forward Voltage: 3.3V
D13  SP3420-04UTG  [uDFN-10]
FB3  MPZ1608S601ATA00  [FP-MPZ1608-0_8-MFG]
FB4  MPZ1608S601ATA00  [FP-MPZ1608-0_8-MFG]
J5  G800W302018EU  [G800W302018EU]
R108  value 100 Ω  [RESC1608X55X30LL15T15]  (hidden comment: ERJ-3EKF1000V)
R109  value 100 Ω  [RESC1608X55X30LL15T15]  (hidden comment: ERJ-3EKF1000V)
R110  value 100 Ω  [RESC1608X55X30LL15T15]  (hidden comment: ERJ-3EKF1000V)
R111  value 100 Ω  [RESC1608X55X30LL15T15]  (hidden comment: ERJ-3EKF1000V)
R112  value 12k  [RESC0402(1005)_L]  (hidden comment: Resistor 12K  +/-1 % 0402 63 mW)
R113  value 10k  [RESC1005X40X25ML05T05]  (hidden comment: Resistor 10k +/-1% 0402 63 mW)
R114  value 10k  [RESC1005X40X25ML05T05]  (hidden comment: Resistor 10k +/-1% 0402 63 mW)
R115  value 10k  [RESC1005X40X25ML05T05]  (hidden comment: Resistor 10k +/-1% 0402 63 mW)
R116  value 10k  [RESC1005X40X25ML05T05]  (hidden comment: Resistor 10k +/-1% 0402 63 mW)
R117  value 22  [RESC0402(1005)_L]  (hidden comment: 22R2J)
R118  value 2k  [RESC0402(1005)_L]  (hidden comment: Resistor 2K +/-5 % 0402 63 mW)
U12  FT4232HL-REEL  [FP-LQFP-64-IPC_A]
U13  93LC56B-I/SN  [SOIC-SN8_L]
X1  ABM3B-12.000MHZ-B2-T  [ABRA-ABM3B-4_V]

### Ports
JTAG_TCK (out), JTAG_TDI (out), JTAG_TDO (out), JTAG_TMS (out), LS_UART0_CTS_IN (out), LS_UART0_RTS_OUT (in), LS_UART0_RX_IN (out), LS_UART0_TX_OUT (in), LS_UART1_RX_IN (out), LS_UART1_TX_OUT (in), LS_UART2_RX_IN (out), LS_UART2_TX_OUT (in), PGM_DONE (in), PGM_INIT_n (bidir), USBD_D_N (bidir), USBD_D_P (bidir)

### Nets
+5: C103.2 U13.8(VCC)
GND: C95.1 C96.1 C97.1 C98.1 C99.1 C100.1 C101.1 C102.2 C103.1 C104.2 D12.2(A) D13.38(GND) J5.1 R112.1 U12.1(GND) U12.5(GND) U12.10(AGND) U12.11(GND) U12.13(TEST) U12.15(GND) U12.25(GND) U12.35(GND) U12.47(GND) U12.51(GND) U13.5(VSS) X1.2(GND) X1.4(GND)
USB_1.8V: C100.2 C101.2 U12.12(VCORE) U12.37(VCORE) U12.49(VREGOUT) U12.64(VCORE)
USB_3.3V: C99.2 FB3.1 FB4.1 R113.2 R114.2 R115.2 R116.2 U12.20(VCCIO) U12.31(VCCIO) U12.42(VCCIO) U12.50(VREGIN) U12.56(VCCIO)
VCC_3.3V: D12.1(K) J5.6
EEP_CLK_$A: R117.1 U12.62(EECLK)
EEP_CLK_$B: R114.1 R117.2 U13.2(CLK)
EEP_CS: R115.1 U12.63(EECS) U13.1(CS)
EEP_DI: R118.2 U12.61(EEDATA) U13.3(DI)
EEP_DO: R116.1 R118.1 U13.4(DO)
F_JTAG_TCK_$1: D13.29 J5.4 R109.1
F_JTAG_TDI_$1: D13.56 J5.2 R111.1
F_JTAG_TDO_$1: D13.47 J5.3 R110.1
F_JTAG_TMS_$1: D13.110 J5.5 R108.1
FTDI_OSCI: C102.1 U12.2(OSCI) X1.1(X1)
FTDI_OSCO: C104.1 U12.3(OSCO) X1.3(X2)
USB_JTAG_VPHY: C97.2 C98.2 FB4.2 U12.4(VPHY)
USB_JTAG_VPLL: C95.2 C96.2 FB3.2 U12.9(VPLL)
USB_RST_n: R113.1 U12.14(~{RESET})
NetR108_2: R108.2 U12.19(ADBUS3) ; port JTAG_TMS
NetR109_2: R109.2 U12.18(ADBUS2) ; port JTAG_TCK
NetR110_2: R110.2 U12.17(ADBUS1) ; port JTAG_TDO
NetR111_2: R111.2 U12.16(ADBUS0) ; port JTAG_TDI
NetR112_2: R112.2 U12.6(REF)
NetU12_7: U12.7(DM) ; port USBD_D_N
NetU12_8: U12.8(DP) ; port USBD_D_P
NetU12_21: U12.21(ADBUS4) ; port PGM_DONE
NetU12_22: U12.22(ADBUS5) ; port PGM_INIT_n
NetU12_26: U12.26(BDBUS0) ; port LS_UART0_TX_OUT
NetU12_27: U12.27(BDBUS1) ; port LS_UART0_RX_IN
NetU12_28: U12.28(BDBUS2) ; port LS_UART0_RTS_OUT
NetU12_29: U12.29(BDBUS3) ; port LS_UART0_CTS_IN
NetU12_38: U12.38(CDBUS0) ; port LS_UART1_TX_OUT
NetU12_39: U12.39(CDBUS1) ; port LS_UART1_RX_IN
NetU12_48: U12.48(DDBUS0) ; port LS_UART2_TX_OUT
NetU12_52: U12.52(DDBUS1) ; port LS_UART2_RX_IN

Not connected (* = marked no-connect by the designer): U12 23(ADBUS6) 24(ADBUS7) 30(BDBUS4)* 32(BDBUS5)* 33(BDBUS6)* 34(BDBUS7)* 36(~{SUSPEND})* 40(CDBUS2)* 41(CDBUS3)* 43(CDBUS4)* 44(CDBUS5)* 45(CDBUS6)* 46(CDBUS7)* 53(DDBUS2)* 54(DDBUS3)* 55(DDBUS4)* 57(DDBUS5)* 58(DDBUS6)* 59(DDBUS7)* 60(~{PWREN})*; U13 6(NC)* 7(NC)*

### Notes on the sheet
- FTDI USB-to-JTAG IC
- External JTAG Bypass Programming
- AMD JTAG Guide (link) <https://docs.amd.com/r/en-US/ug1514-smartlynq-plus-module/JTAG-Target-Interface>
- FTDI : Power LC Filters
- FTDI
- *RX_IN =Incominng from USB Device
- *TX_OUT = Output to USB Device
- FTDI : EEPROM Memory
- FTDI : 12Mhz Oscilator

### Library data of the parts
C95 C97 C99 C100 = CMP-001-00076-5: as C66 on sheet Ethernet_PHY; Max Operating Temperature: 85°C; Min Operating Temperature: -55°C; Voltage Rating: 10V; Pins: 2; Mounting Technology: SMT; Case/Package: 0603
C96 C98 C101 C103 = CMP-001-00001-7: Chip Capacitor, 0.1 uF, +/- 5%, 16 V, 0402 (1005 Metric); Capacitor Type: Ceramic; Voltage Rating: 16V; Pins: 2; Tolerance: 5%; Case/Package: 0402; Max Operating Temperature: 125°C; RoHS Compliant: True; Mounting Technology: SM; Min Operating Temperature: -55°C
C102 C104 = CMP-001-00104-1: Ceramic Capacitor, Multilayer, Ceramic, 50V, 1% +Tol, 1% -Tol, C0G, 30ppm/Cel TC, 0.000027uF, Surface Mount, 0402; Max Operating Temperature: 125°C; Capacitor Type: Ceramic; Min Operating Temperature: -55°C; Pins: 2; RoHS Compliant: Yes; Mounting Technology: Surface Mount; Case/Package: 0402; ComponentLink1Description: Capacitor Type; ComponentLink1URL: COG
D12 = CMP-004-00034-1: Zener Diode, 3.3V V(Z), 5%, 0.5W, Silicon, Unidirectional; Min Operating Temperature: -55°C; Max Operating Temperature: 150°C; Pins: 2; RoHS Compliant: Yes
D13 = CMP-004-00047-1: TVS Diode Array Low Capacitance ESD Protection 4-Channel (Vwork=3V3, Vclamp=6V); Manufacturer: Littelfuse; Design Item ID: SP3420-04UTG; Manufacturer Part Number: SP3420-04UTG; Source: Schematic-Lib-PhilsLab.SchLib
FB3 FB4 = CMP-08257-000179-1: Power line Ferrite Bead 600Ω @ 100MHz 1A DCR 0.15Ω SMD 0603; Impedance: 600R; DC Resistance (DCR): 150mR; Tolerance: 25%; Depth: 0.8mm; Packaging: Tape and Reel; Package Quantity: 4000; Height: 0.8mm; Length: 0.063inch; Series: MPZ; Weight: 7.1E-05oz; Width: 0.8mm; Mount: Surface Mount; Case Code (Imperial): 0603; Case/Package: 0603; Max Operating Temperature: 125°C; Max DC Current: 1A; Test Frequency: 100MHz; Min Operating Temperature: -55°C; Current Rating: 1A; Core Material: Ferrite; RoHS Compliant: Yes; REACH SVHC: No SVHC; Case Code (Metric): 1608; Termination: SMD/SMT; Lead Free: Lead Free
J5 = CMP-002-00119-1: Pin Header 6 Position 2.54mm Pitch; Manufacturer: Amphenol; Design Item ID: G800W302018EU; Source: Schematic-Lib-PhilsLab.SchLib; Manufacturer Part Number: G800W302018EU
R108-R111 = CMP-2000-00179-1: Manufacturer: Panasonic; Part Number: ERJ-3EKF1000V
R112 = CMP-009-00173-4: Chip Resistor, 12 kOhms, +/-1 %, 63 mW, -55 to 155 degC, 0402; Power: 63mW; Tolerance: 1%; Pins: 2; Max Operating Temperature: 155°C; Min Operating Temperature: -55°C; Case/Package: 0402
R113 = CMP-009-00019-7: Chip Resistor, 10 KOhm, +/- 1%, 63 mW, -55 to 155 degC, 0402 (1005 Metric); Power: 63mW; Voltage Rating: 50V; Tolerance: 1%; Mounting Technology: SM; Min Operating Temperature: -55°C; Max Operating Temperature: 155°C; Case/Package: 0402; RoHS Compliant: True; Pins: 2
R114-R116 = CMP-009-00019-6: Chip Resistor, 10 KOhm, +/- 1%, 63 mW, -55 to 155 degC, 0402 (1005 Metric); Power: 63mW; Voltage Rating: 50V; Tolerance: 1%; Mounting Technology: SM; Min Operating Temperature: -55°C; Max Operating Temperature: 155°C; Case/Package: 0402; RoHS Compliant: True; Pins: 2
R117 = CMP-009-00082-3: 22R 0.063W 5% 0402 (1005 Metric)  SMD; Power: 63mW; Tolerance: 5%; Case/Package: 0402; Pins: 2; Mounting Technology: SMT
R118 = CMP-009-00138-4: Chip Resistor, 2 kOhms, +/-5 %, 63 mW, -55 to 155 degC, 0402; Tolerance: 5%; Power: 63mW; Max Operating Temperature: 155°C; Min Operating Temperature: -55°C; Pins: 2; Case/Package: 0402
U12 = CMP-016-00010-1: Serial I/O Controller, 4 Channel(s), 1.5MBps, CMOS, PQFP64; Max Supply Voltage: 1.98V; Min Supply Voltage: 1.62V; Nominal Supply Voltage: 1.8V; RoHS Compliant: Yes; Case/Package: LFQFP; Pins: 64; Min Operating Temperature: -40°C; Max Operating Temperature: 85°C
U13 = CMP-0162-00077-1: 2K, 128x16-bit, 2.5V Microwire Serial EEPROM, 8-Pin SOIC 150mil, Industrial Temperature; Code_IPC: SOIC127P600-8; PackageVersion: revBB, Aug-2009; PackageDescription: 8-Lead Plastic Small Outline (SN) - Narrow, 3.90mm Body [SOIC]; DatasheetVersion: revF, May-2008; PackageReference: SOIC-SN8; Code_JEDEC: MS-012; ComponentLink1Description: Datasheet URL; ComponentLink1URL: https://ww1.microchip.com/downloads/en/DeviceDoc/21794G.pdf
X1 = CMP-003-00015-2: Ceramic SMD Crystal, 12 MHz, +/- 20 ppm, 18 pF, -20 to 70 degC, 4-Pin SMD, RoHS, Tape and Reel; Manufacturer: Abracon; ESR: 70; Load Capacitance: 18pF; Tolerance: 20ppm; Frequency: 12MHz; Resistance: 70Ohm; Mounting Technology: SM; Packaging: TapeandReel; Datasheet URL: http://www.abracon.com/Resonators/abm3b.pdf; Manufacturer URL: http://www.abracon.com/; RoHS Compliant: True; Frequency Tolerance: 20ppm; Datasheet Version: Aug-15; Max Operating Temperature: 70°C; Package Reference: ABM3B; Min Operating Temperature: -20°C; Pins: 4; Package Quantity: 1000; Package Description: 4-Pin Surface Mount Device, Body 5 x 3.2 mm; Case/Package: CSMD

## Sheet USB_PowerOnly.SchDoc
size A2; SheetNumber: 2; SheetTotal: 14
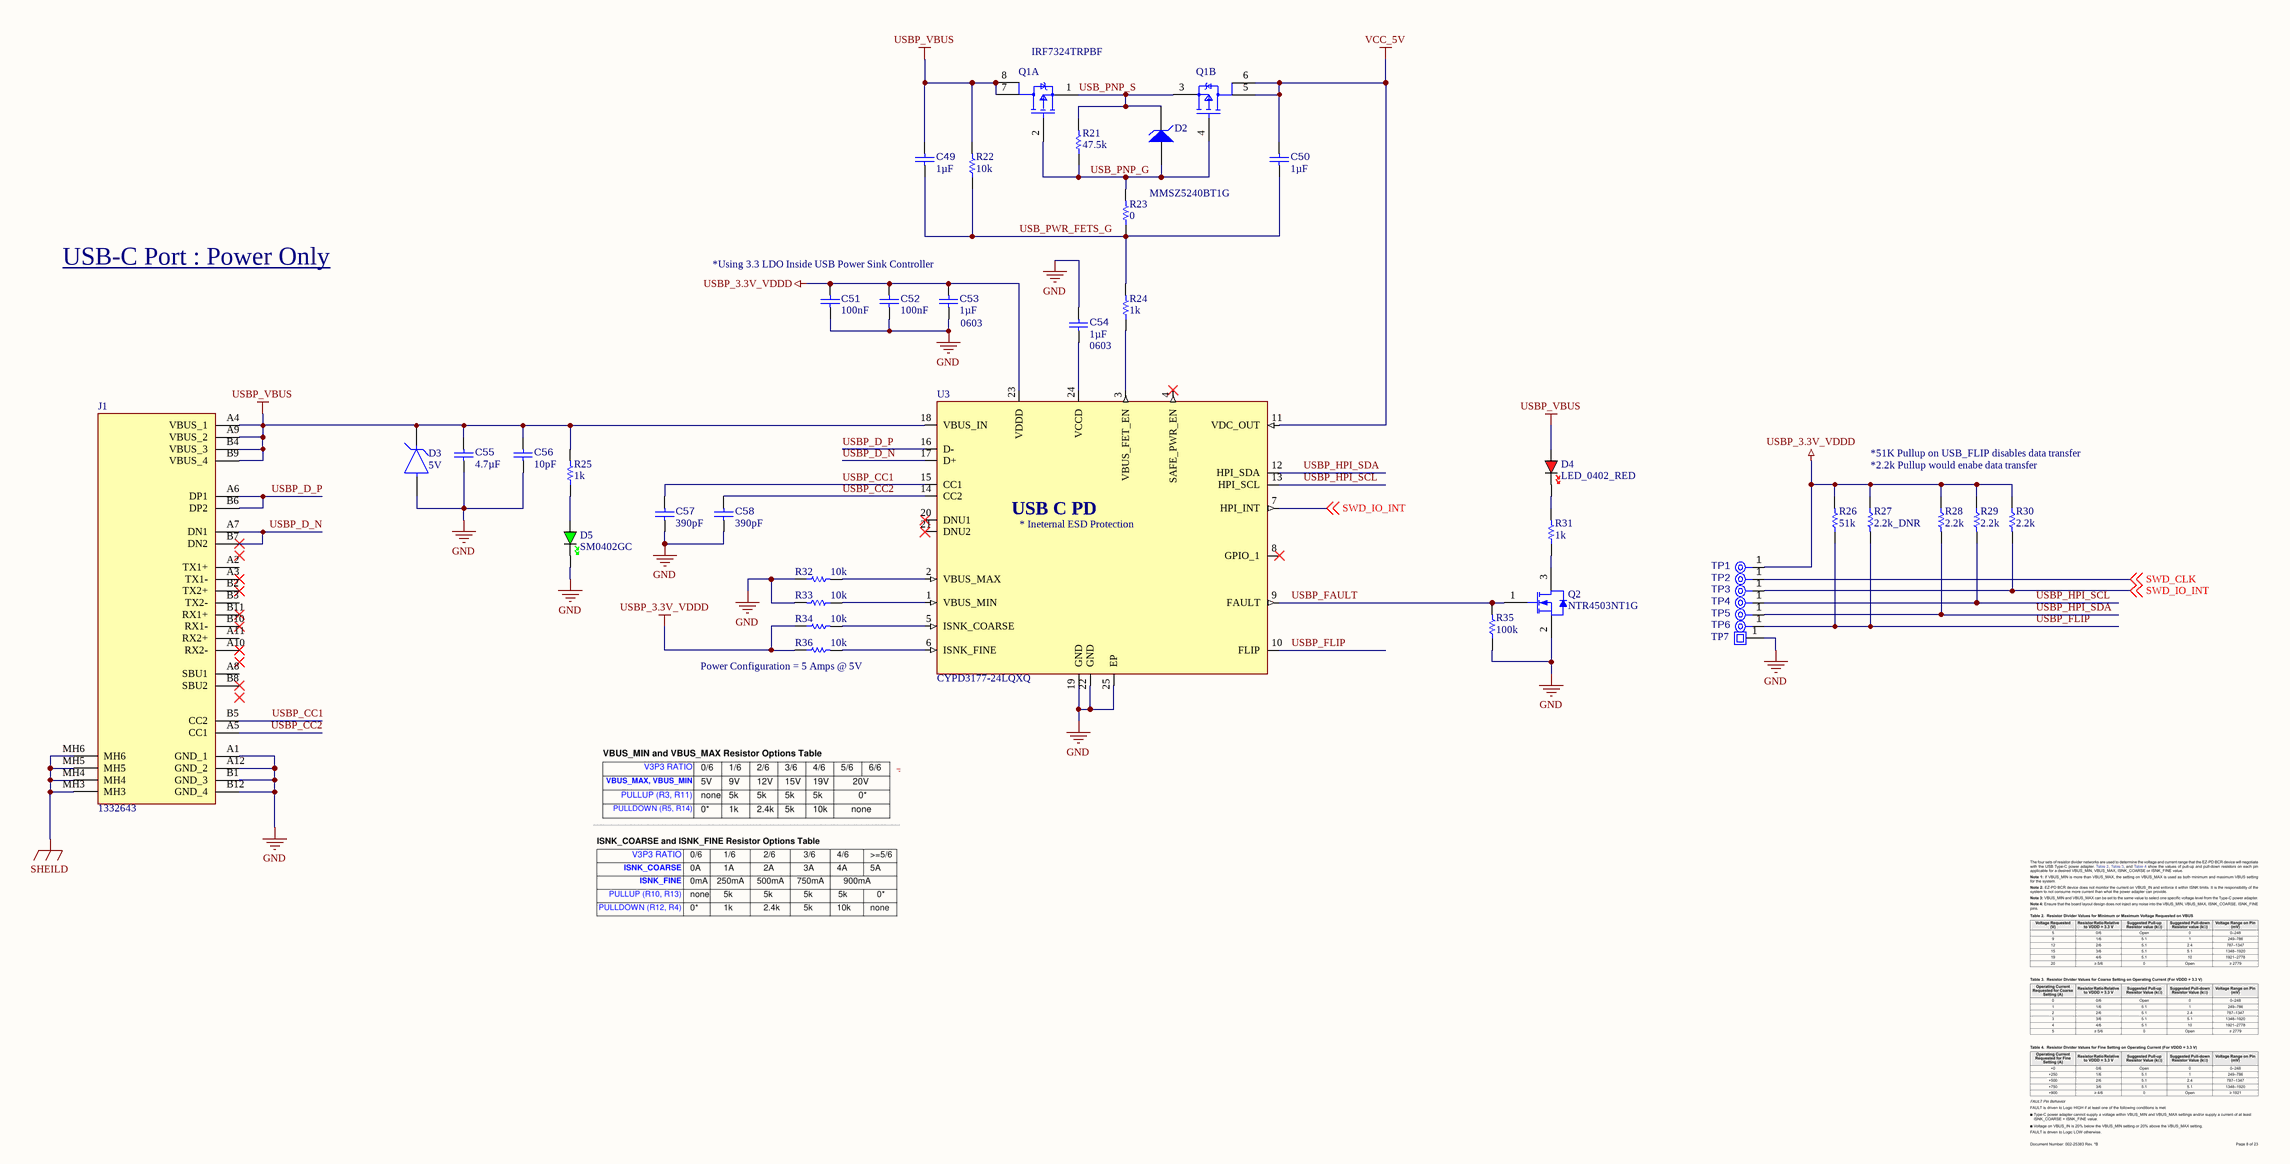
[diagram p10: USB_PowerOnly.SchDoc]

### Parts
C49  value 1µF  [CAPC2013X135X45NL10T25]  (hidden comment: Capacitor 1 uF +/- 10% 50 V 0805)
C50  value 1µF  [CAPC2013X135X45NL10T25]  (hidden comment: Capacitor 1 uF +/- 10% 50 V 0805)
C51  value 100nF  [CAPC2013X145X48ML20T23]  (hidden comment: VJ0805Y104JXXAT)
C52  value 100nF  [CAPC2013X145X48ML20T23]  (hidden comment: VJ0805Y104JXXAT)
C53  value 1µF  Case/Package: 0603  [CAPC1608X90X35LL15T15]  (hidden comment: 0603YC105JAT2A)
C54  value 1µF  Case/Package: 0603  [CAPC1608X90X35LL15T15]  (hidden comment: 0603YC105JAT2A)
C55  value 4.7µF  [CAPC0805(2012)145_L]  (hidden comment: Capacitor 4.7µF +/-40% 25V 0805)
C56  value 10pF  [CAPC1005X55X25ML05T05]  (hidden comment: Capacitor 10 pF +/- 5% 50 V 0402)
C57  value 390pF  [FP-C0402-BB-MFG]  (hidden comment: C0402C391K4RACTU)
C58  value 390pF  [FP-C0402-BB-MFG]  (hidden comment: C0402C391K4RACTU)
D2  MMSZ5240BT1G  [ONSC-SOD-123-2-425-04_V]
D3  Reverse Standoff Voltage: 5V  [FP-SMA-MFG]  (hidden comment: SMAJ5.0A-13-F)
D4  LED_0402_RED  [LED_0402_RED]
D5  SM0402GC  [FP-SM0402GC-MFG]
J1  1332643  [1332643]
Q1  IRF7324TRPBF  [FP-PG-DSO-8-IPC_B]  (parts A,B of 2)
Q2  NTR4503NT1G  [ONSC-SOT-23-3-318-08_V]
R21  value 47.5k  [RESC0402(1005)_L]  (hidden comment: Resistor 47K5 +/-1 % 0402 63 mW)
R22  value 10k  [RESC1005X40X25ML05T05]  (hidden comment: Resistor 10k +/-1% 0402 100 mW)
R23  value 0  [RESC1005X40X25ML05T05]  (hidden comment: Resistor 0R +/- 5% 0402 100 mW)
R24  value 1k  [RESC0402(1005)_L]  (hidden comment: Resistor 1K +/-5 % 0402 63 mW)
R25  value 1k  [RESC0402(1005)_L]  (hidden comment: Resistor 1K +/-5 % 0402 63 mW)
R26  value 51k  [RESC1005X40X25ML05T10]  (hidden comment: Resistor 51k +/-5% 0402 63 mW)
R27  value 2.2k_DNR  [RESC0402(1005)_L]  (hidden comment: Resistor 2K2  +/-5 % 0402 63 mW)
R28  value 2.2k  [RESC0402(1005)_L]  (hidden comment: Resistor 2K2  +/-5 % 0402 63 mW)
R29  value 2.2k  [RESC0402(1005)_L]  (hidden comment: Resistor 2K2  +/-5 % 0402 63 mW)
R30  value 2.2k  [RESC0402(1005)_L]  (hidden comment: Resistor 2K2  +/-5 % 0402 63 mW)
R31  value 1k  [RESC0402(1005)_L]  (hidden comment: Resistor 1K +/-5 % 0402 63 mW)
R32  value 10k  [RESC1005X40X25ML05T05]  (hidden comment: Resistor 10k +/-1% 0402 100 mW)
R33  value 10k  [RESC1005X40X25ML05T05]  (hidden comment: Resistor 10k +/-1% 0402 100 mW)
R34  value 10k  [RESC1005X40X25ML05T05]  (hidden comment: Resistor 10k +/-1% 0402 100 mW)
R35  value 100k  [RESC1005X40X25ML05T05]  (hidden comment: Resistor 100k +/-1% 0402 63 mW)
R36  value 10k  [RESC1005X40X25ML05T05]  (hidden comment: Resistor 10k +/-1% 0402 100 mW)
TP1  TPAD6R  [TP06R]  (value not drawn)  (no BOM)
TP2  TPAD6R  [TP06R]  (value not drawn)  (no BOM)
TP3  TPAD6R  [TP06R]  (value not drawn)  (no BOM)
TP4  TPAD6R  [TP06R]  (value not drawn)  (no BOM)
TP5  TPAD6R  [TP06R]  (value not drawn)  (no BOM)
TP6  TPAD6R  [TP06R]  (value not drawn)  (no BOM)
TP7  TestPoint_Ground_0.6mm  [TestPoint_Ground_0.6mm-Footprint-1]  (value not drawn)
U3  CYPD3177-24LQXQ  [QFN-24-0MM5]

### Nets
GND: C51.1 C52.1 C53.1 C54.1 C55.1 C56.1 C57.1 C58.1 D3.2(A) D5.K J1.A1(GND_1) J1.A12(GND_2) J1.B1(GND_3) J1.B12(GND_4) Q2.2(S) R32.1 R33.2 R35.1 U3.19(GND) U3.22(GND) U3.25(EP)
SHEILD: J1.MH3 J1.MH4 J1.MH5 J1.MH6
USBP_3.3V_VDDD: C51.2 C52.2 C53.2 R26.2 R27.1 R28.1 R29.1 R30.1 R34.1 R36.1 TP1.1(TP) U3.23(VDDD)
USBP_VBUS: C49.2 C55.2 C56.2 D3.1(C) D4.A J1.A4(VBUS_1) J1.A9(VBUS_2) J1.B4(VBUS_3) J1.B9(VBUS_4) Q1.7(D1) Q1.8(D1) R22.2 R25.2 U3.18(VBUS_IN)
VCC_5V: C50.2 Q1.5(D2) Q1.6(D2) U3.11(VDC_OUT)
SWD_CLK: TP2.1(TP) ; off-sheet SWD_CLK
SWD_IO_INT: R30.2 TP3.1(TP) U3.7(HPI_INT) ; off-sheet SWD_IO_INT
USB_PNP_G: D2.2(A) Q1.2(G1) Q1.4(G2) R21.1 R23.2
USB_PNP_S: D2.1(K) Q1.1(S1) Q1.3(S2) R21.2
USB_PWR_FETS_G: C49.1 C50.1 R22.1 R23.1 R24.2
USBP_CC1: C57.2 J1.B5(CC2) U3.15(CC1)
USBP_CC2: C58.2 J1.A5(CC1) U3.14(CC2)
USBP_D_N: J1.A7(DN1) J1.B7(DN2) U3.17(D+)
USBP_D_P: J1.A6(DP1) J1.B6(DP2) U3.16(D-)
USBP_FAULT: Q2.1(G) R35.2 U3.9(FAULT)
USBP_FLIP: R26.1 R27.2 TP6.1(TP) U3.10(FLIP)
USBP_HPI_SCL: R29.2 TP4.1(TP) U3.13(HPI_SCL)
USBP_HPI_SDA: R28.2 TP5.1(TP) U3.12(HPI_SDA)
NetC54_2: C54.2 U3.24(VCCD)
NetD4_K: D4.K R31.2
NetD5_A: D5.A R25.1
NetQ2_3: Q2.3(D) R31.1
NetR24_1: R24.1 U3.3(VBUS_FET_EN)
NetR32_2: R32.2 U3.2(VBUS_MAX)
NetR33_1: R33.1 U3.1(VBUS_MIN)
NetR34_2: R34.2 U3.5(ISNK_COARSE)
NetR36_2: R36.2 U3.6(ISNK_FINE)

Not connected (* = marked no-connect by the designer): J1 A2(TX1+) A3(TX1-)* A8(SBU1) A10(RX2-)* A11(RX2+) B2(TX2+)* B3(TX2-) B8(SBU2)* B10(RX1-)* B11(RX1+)*; TP7 1; U3 4(SAFE_PWR_EN)* 8(GPIO_1)* 20(DNU1)* 21(DNU2)*

### Notes on the sheet
- USB-C Port : Power Only
- *Using 3.3 LDO Inside USB Power Sink Controller
- *51K Pullup on USB_FLIP disables data transfer
- *2.2k Pullup would enabe data transfer
- (near R36) Power Configuration = 5 Amps @ 5V
- (in symbol CMP-049-000093-2) USB C PD; * Ineternal ESD Protection

### Library data of the parts
C49 C50 = CMP-001-00007-7: Chip Capacitor, 1 uF, +/- 10%, 50 V, 0805 (2012 Metric); Voltage Rating: 50V; Capacitor Type: Ceramic; Tolerance: 10%; Case/Package: 0805; RoHS Compliant: True; Min Operating Temperature: -55°C; Max Operating Temperature: 125°C; Mounting Technology: SM; Pins: 2
C51 C52 = CMP-001-00087-1: Ceramic Capacitor, Multilayer, Ceramic, 25V, 5% +Tol, 5% -Tol, X7R, 15% TC, 0.1uF, Surface Mount, 0805; Min Operating Temperature: -55°C; Case/Package: 0805; Max Operating Temperature: 125°C; Capacitor Type: Ceramic; Mounting Technology: Surface Mount; Pins: 2; RoHS Compliant: Yes
C53 C54 = CMP-001-00114-1: 0603 1 uF 16 V ±5 % Tolerance X7R Surface Mount Multilayer Ceramic Capacitor; Tolerance: 5%; Voltage Rating: 16V; Min Operating Temperature: -55°C; Max Operating Temperature: 125°C; Mounting Technology: Surface Mount
C55 = CMP-001-00080-5: Chip Capacitor, 4.7µF +/-40%, 25V, 0805, Thickness 1.45 mm; Tolerance: 20%; Max Operating Temperature: 85°C; Voltage Rating: 25V; Mounting Technology: SMT; Case/Package: 0805; Pins: 2; Min Operating Temperature: -55°C
C56 = CMP-001-00013-7: Chip Capacitor, 10 pF, +/- 5%, 50 V, 0402 (1005 Metric); Voltage Rating: 50V; Capacitor Type: Ceramic; Case/Package: 0402; Pins: 2; Tolerance: 5%; Max Operating Temperature: 125°C; RoHS Compliant: True; Mounting Technology: SM; Min Operating Temperature: -55°C
C57 C58 = CMP-001-00118-1: Multilayer Ceramic Capacitors MLCC - SMD/SMT 16V 390pF X7R 0402 10%; Max Operating Temperature: 125°C; Voltage Rating: 16V; Tolerance: 10%; Pins: 2; Case/Package: 0402; Min Operating Temperature: -55°C; Mounting Technology: Surface Mount
D2 = CMP-1060-00549-1: Zener Voltage Regulator, 500 mW, 2-Pin SOD-123, Pb-Free, Tape and Reel; Manufacturer: On Semiconductor; P Max (W): 0.5; VZ Typ (V): 10; PackageVersion: Rev. G, 10/2009; ComponentLink2Description: Datasheet; RoHS: Pb-Free; ComponentLink2URL: http://www.onsemi.com/pub_link/Collateral/MMSZ5221BT1-D.PDF; PackageReference: SOD-123-2-425-04; ComponentLink1URL: http://www.onsemi.com/; ComponentLink3Description: Package Specification; ComponentLink1Description: Manufacturer URL; Packing: Tape and Reel; Mounting Technology: Surface Mount; ComponentLink3URL: http://www.onsemi.com/pub_link/Collateral/425-04.PDF; PackageDescription: 2-Pin SOD, Body 1.6 x 2.69 mm; PartNumber: MMSZ5240BT1G; DatasheetVersion: Rev. 12
D3 = CMP-004-00031-1: TVS DIODE 5V 9.2V SMA; Manufacturer: Diodes Inc.; Peak Pulse Current: 43.5A; Direction: Unidirectional; Standoff Height: 0.05mm; Max Junction Temp: +150°C; Breakdown Voltage: 6.4V; Peak Pulse Power: 400W; Number Of Channels: 1; Pins: 2; Device Class L3: unset; Device Class L1: Circuit Protection; Category: Diode; Manufacturer Part Number: SMAJ5.0A-13-F; Footprint Url: https://www.diodes.com/assets/Package-Files/SMA.pdf; Case/Package: SMA; Source: CodyStates.SchLib; Component Type: Standard; Temperature: -55°C to +150°C; Temperature Range High: 150°C; Automotive: No; Mouser Description: TVS DIODE 5V 9.2V SMA; Octopart: https://octopart.com/smaj5.0a-13-f-diodes+inc.-350158; Lead Free: Yes; Device Class L2: TVS Diodes; RoHS: TRUE; Clamping Voltage: 9.2V; Height: 2.4mm; Temperature Range Low: -55°C; Design Item ID: SMAJ5.0A-13-F; Digikey Description: TVS DIODE 5V 9.2V SMA
D4 = CMP-004-00045-1: LED 0402 RED SMD; Source: Schematic-Lib-PhilsLab.SchLib; Design Item ID: LED_0402_RED
D5 = CMP-007-00038-1: LED Uni-Color Green 575nm 2-PinChip 0402(1006Metric) T/R; Forward Voltage: 2.6V; Forward Current: 30mA; Min Operating Temperature: -30°C; Case/Package: 0402; Max Operating Temperature: 80°C; Mounting Technology: Surface Mount
J1 = CMP-002-00162-2: USB-C connector. Horizontal layout. 5A amp rated.; Manufacturer_Name: Phoenix Contact; Mouser Part Number: 651-1332643; Manufacturer_Part_Number: 1332643; Height: 3.31mm; Arrow Part Number: 1332643; Mouser Price/Stock: https://www.mouser.co.uk/ProductDetail/Phoenix-Contact/1332643?qs=Znm5pLBrcAJhPoOCsTWMGg%3D%3D; Design Item ID: 1332643; Datasheet Link: http://www.phoenixcontact.com/de/produkte/1332643; Arrow Price/Stock: https://www.arrow.com/en/products/1332643/phoenix-contact?utm_currency=USD&region=nac; Source: SamacSys.SchLib
Q1 = CMP-32901-000434-1: MOSFET 2P-CH 20V 9A 8-SOIC; Drain to Source Breakdown Voltage: -20V; Turn-Off Delay Time: 170ns; Max Power Dissipation: 2W; Threshold Voltage: -1V; Drain to Source Resistance: 26mR; Rds On Max: 18mR; Gate to Source Voltage (Vgs): 12V; Turn-On Delay Time: 17ns; Input Capacitance: 2.94nF; Number of Pins: 8; Width: 0.157inch; Lead Free: Lead Free; REACH SVHC: No SVHC; Halogen Free: Halogen Free; Mount: Surface Mount; Length: 0.196inch; Continuous Drain Current (ID): 9A; Drain to Source Voltage (Vdss): -20V; Height: 0.059inch; RoHS Compliant: Yes; Max Dual Supply Voltage: -20V; Power Dissipation: 2W; Case/Package: SO; Packaging: Tape and Reel; Max Operating Temperature: 150°C; Min Operating Temperature: -55°C
Q2 = CMP-1058-00742-1: Power MOSFET, 30 V, 2.5 A, Single N-Channel, 3-Pin SOT-23, Pb-Free, Tape and Reel; Manufacturer: On Semiconductor; Qrr Typ (nC): 4; ID Max (A): 2.5; VGS(th) Max (V): 3; VGS Max (V): 20; Channel Polarity: N Channel; V(BR)DSS Min (V): 30; ComponentLink3URL: http://www.onsemi.cn/pub_link/Collateral/318-08.PDF; PackageReference: SOT-23-3-318-08; ComponentLink2URL: http://www.onsemi.cn/pub_link/Collateral/NTR4503N-D.PDF; ComponentLink2Description: Datasheet; ComponentLink1Description: Manufacturer URL; Configuration: Single; ComponentLink1URL: http://www.onsemi.com/; PackageVersion: Rev. AP, 11/2009; Package Type: SOT-23-3; DatasheetVersion: Rev. 6; ComponentLink3Description: Package Specification; PartNumber: NTR4503NT1G; Packing: Tape and Reel; RoHS: Pb-Free; Mounting Technology: Surface Mount; PackageDescription: 3-Pin Small Outline Transistor, Body 2.92 x 1.3 mm, Pitch 0.95 mm
R21 = CMP-009-00137-4: Chip Resistor, 47,5 kOhms, +/-1 %, 63 mW, -55 to 155 degC, 0402; Tolerance: 1%; Power: 63mW; Pins: 2; Case/Package: 0402; Min Operating Temperature: -55°C; Max Operating Temperature: 155°C
R22 R32-R34 R36 = CMP-009-00015-6: Chip Resistor, 10 KOhm, +/- 1%, 0.1 W, -55 to 155 degC, 0402 (1005 Metric); Voltage Rating: 50V; Power: 100mW; Max Operating Temperature: 155°C; Case/Package: 0402; Tolerance: 1%; Min Operating Temperature: -55°C; Pins: 2; Mounting Technology: SM; RoHS Compliant: True
R23 = CMP-009-00005-6: Chip Resistor, 0 Ohm, 0.1 W, -55 to 155 degC, 0402 (1005 Metric); Voltage Rating: 50V; Power: 100mW; Case/Package: 0402; Min Operating Temperature: -55°C; Mounting Technology: SM; Pins: 2; Tolerance: 5%; Max Operating Temperature: 155°C; RoHS Compliant: True
R24 R25 R31 = CMP-009-00157-4: Chip Resistor, 1 kOhms, +/-5 %, 63 mW, -55 to 155 degC, 0402; Tolerance: 5%; Power: 63mW; Pins: 2; Max Operating Temperature: 155°C; Min Operating Temperature: -55°C; Case/Package: 0402
R26 = CMP-009-00000-6: Chip Resistor, 51 KOhm, +/- 5%, 0.063 W, -55 to 155 degC, 0402 (1005 Metric); Power: 63mW; Tolerance: 5%; Pins: 2; RoHS Compliant: True; Max Operating Temperature: 155°C; Mounting Technology: SM; Min Operating Temperature: -55°C; Case/Package: 0402
R27-R30 = CMP-009-00166-4: Chip Resistor, 2,2 kOhms, +/-5 %, 63 mW, -55 to 155 degC, 0402; Power: 63mW; Tolerance: 5%; Max Operating Temperature: 155°C; Pins: 2; Case/Package: 0402; Min Operating Temperature: -55°C
R35 = CMP-009-00021-6: Chip Resistor, 100 KOhm, +/- 1%, 0.063 W, -55 to 155 degC, 0402 (1005 Metric); Power: 63mW; Voltage Rating: 50V; Case/Package: 0402; RoHS Compliant: True; Max Operating Temperature: 155°C; Mounting Technology: SM; Tolerance: 1%; Min Operating Temperature: -55°C; Pins: 2
TP1-TP6 = CMP-00028-00002-2: 0.6mm round; Pins: 1
TP7 = CMP-00030-00005-1: A 0.6mm square test point that is specifically designed to be a ground connection and stand out from the other signals.
U3 = CMP-049-000093-2: USB Type-C Port Controller for Power Sinks; Manufacturer: Cypress Semicon; Distributor Link: https://www.lcsc.com/product-detail/USB-ICs_Cypress-Semicon-CYPD3177-24LQXQ_C2959321.html; Design Item ID: CYPD3177-24LQXQ; Manufacturer Part Number: CYPD3177-24LQXQ